# Altium project SmartHub Carrier.PrjPcb (part 2 of 2)

## Sheet 601_USBHub-Grid-Part1.SchDoc: USB Hub Grid Connections Part 1
size A2; Organization: Greenfield Tech Solutions; Address1: Molendreef 33; Address2: Ossendrecht; Address3: 4641CS; Address4: The Netherlands; DocumentNumber: P234; Revision: 0.6; SheetNumber: 7; SheetTotal: 9
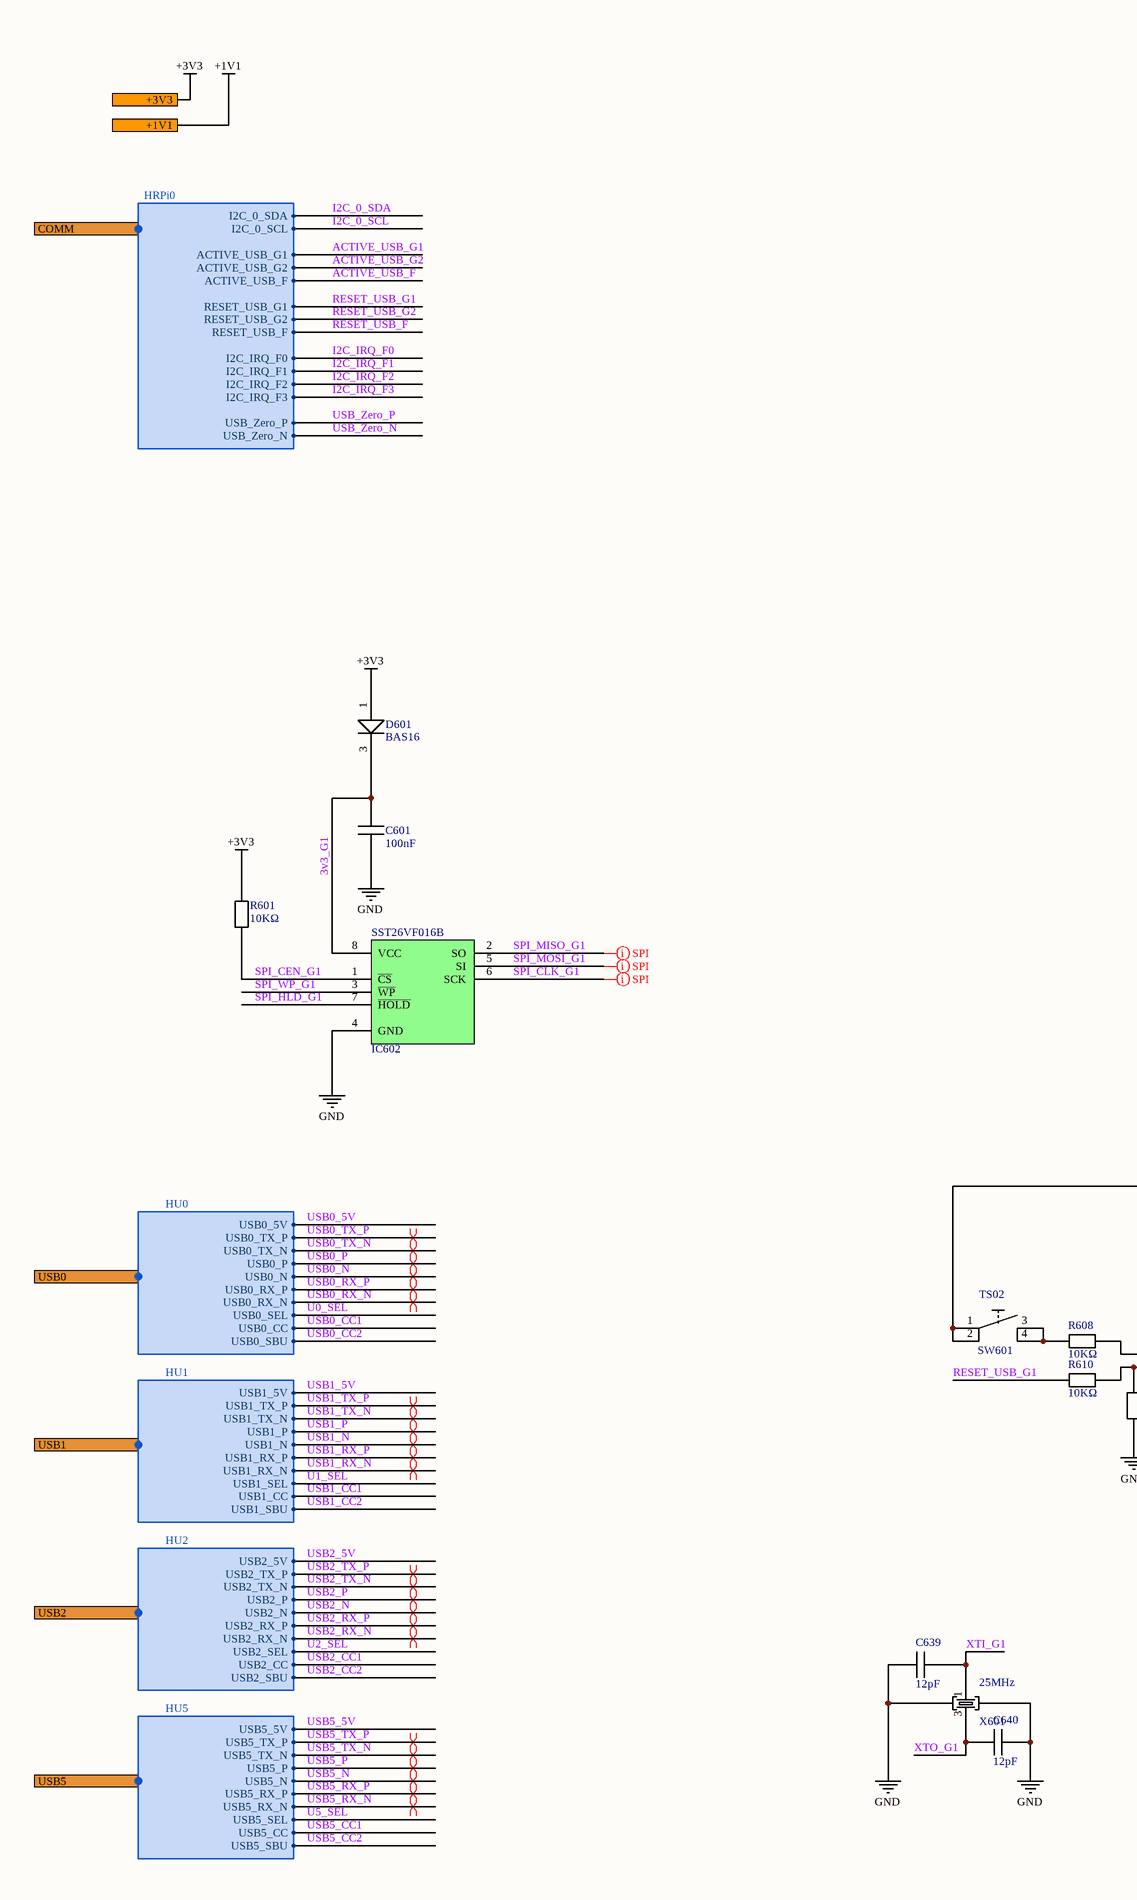
[diagram p14: 601_USBHub-Grid-Part1.SchDoc, left]
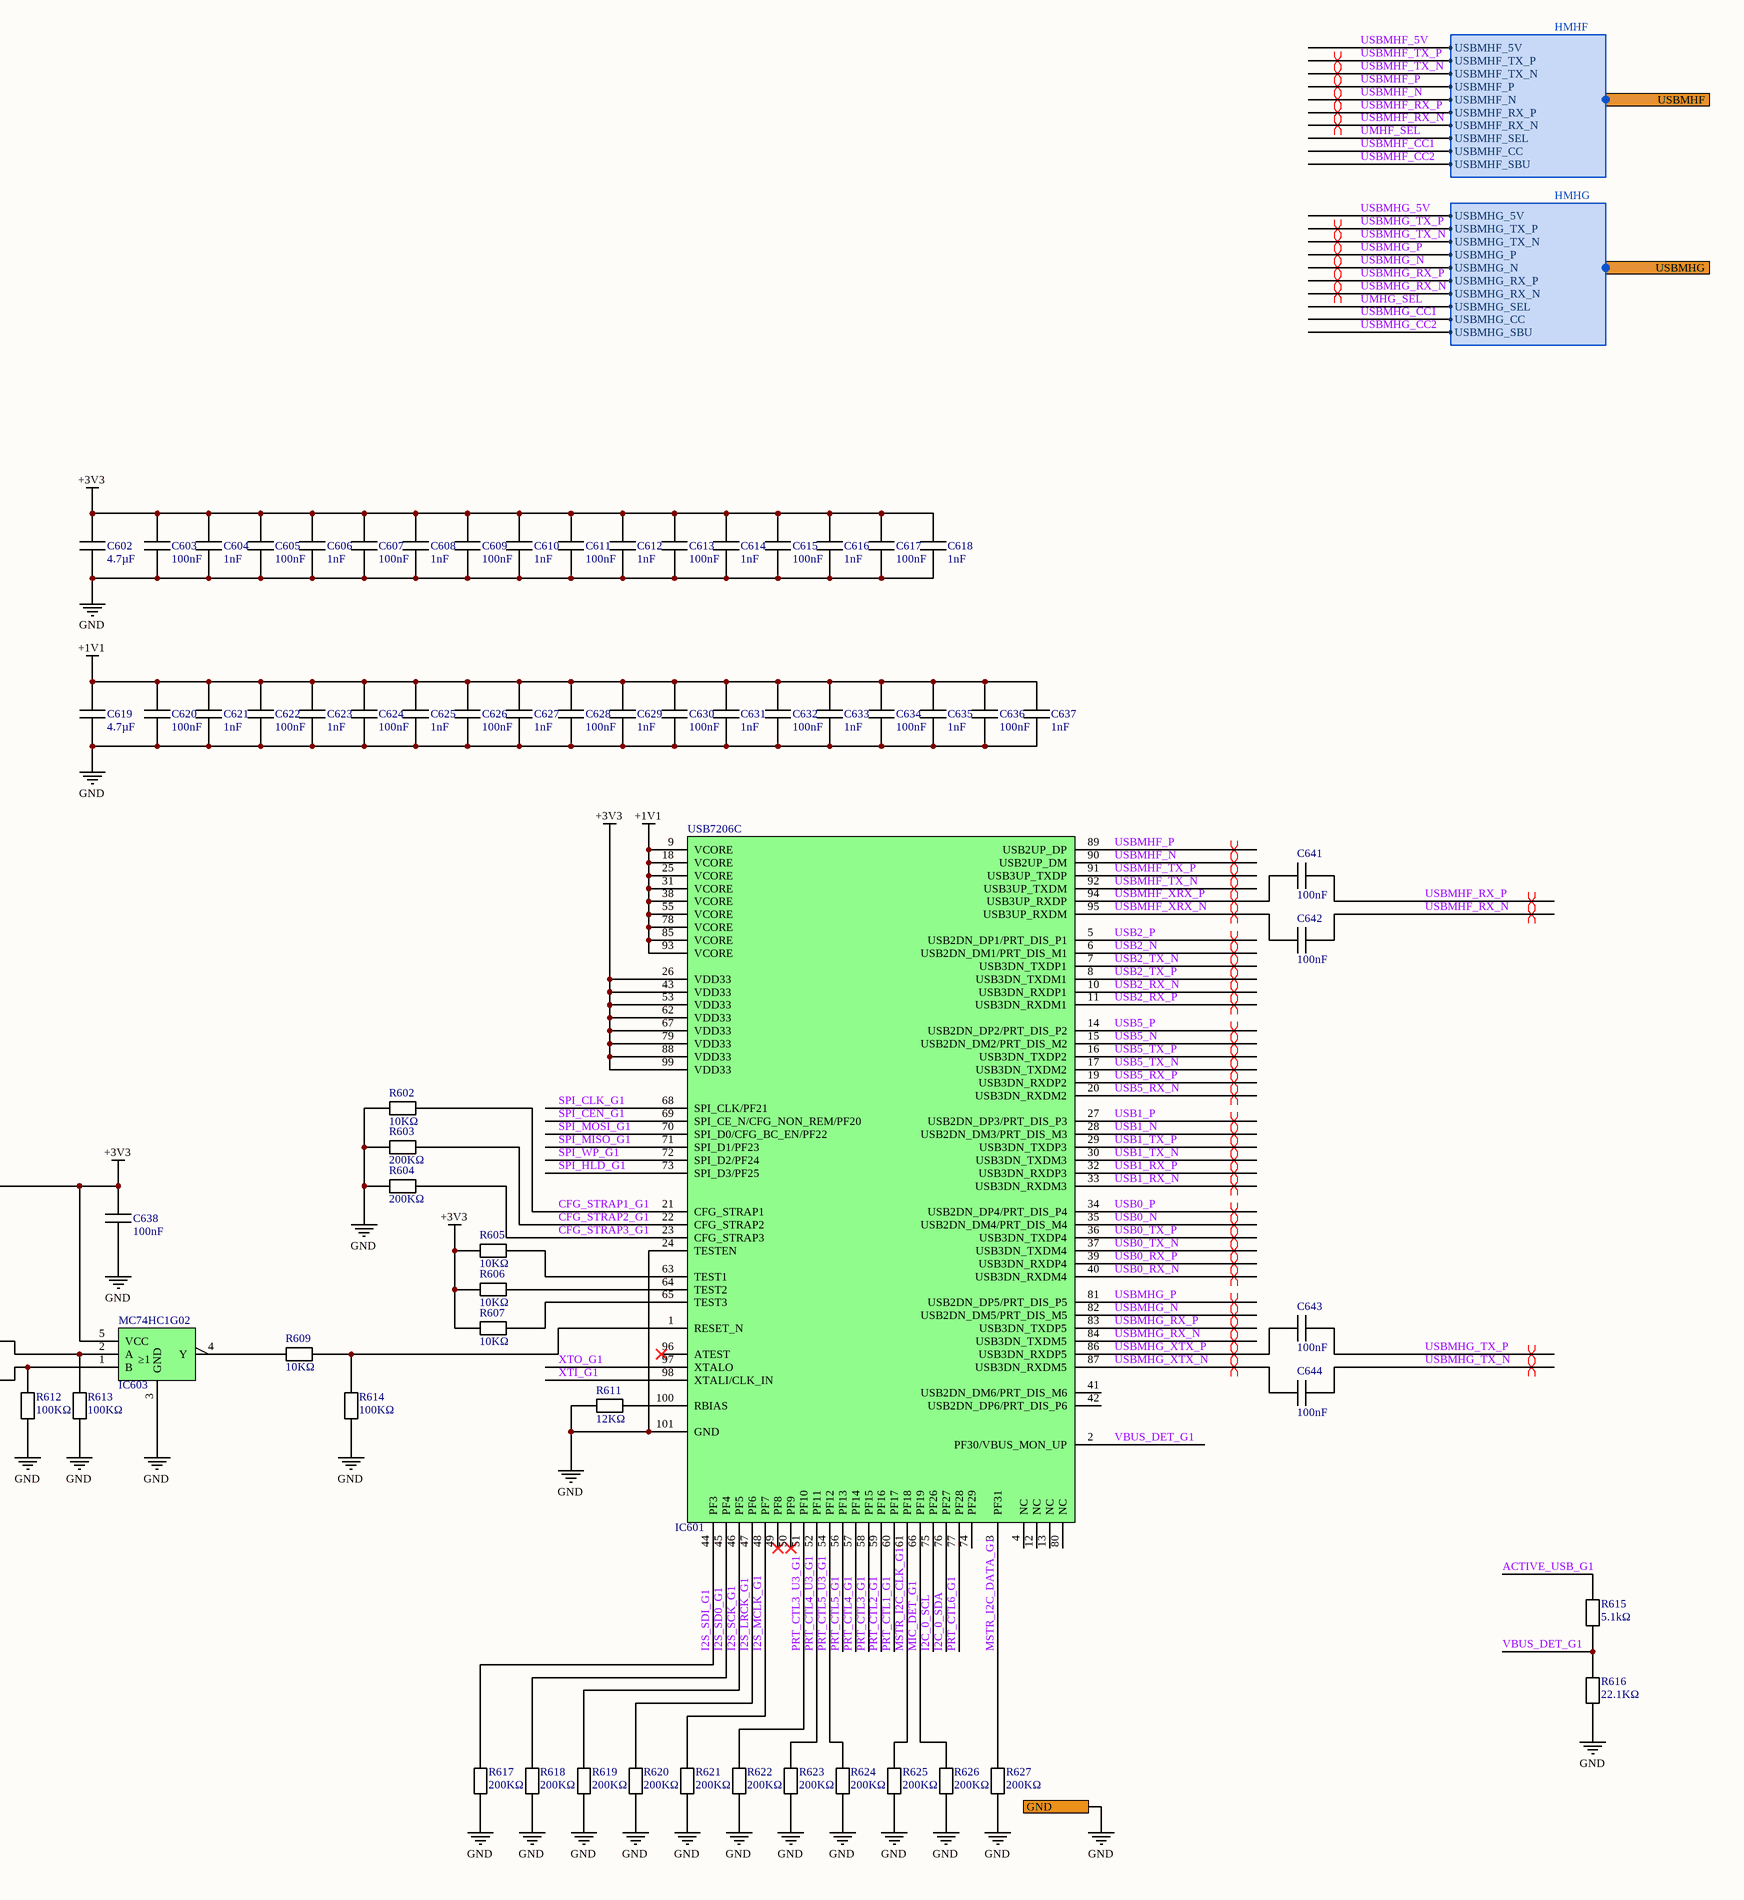
[diagram p15: 601_USBHub-Grid-Part1.SchDoc, right]

### Parts
C601  100nF  [C0402]
C602  4.7µF  [C0603]
C603  100nF  [C0402]
C604  1nF  [C0402]
C605  100nF  [C0402]
C606  1nF  [C0402]
C607  100nF  [C0402]
C608  1nF  [C0402]
C609  100nF  [C0402]
C610  1nF  [C0402]
C611  100nF  [C0402]
C612  1nF  [C0402]
C613  100nF  [C0402]
C614  1nF  [C0402]
C615  100nF  [C0402]
C616  1nF  [C0402]
C617  100nF  [C0402]
C618  1nF  [C0402]
C619  4.7µF  [C0603]
C620  100nF  [C0402]
C621  1nF  [C0402]
C622  100nF  [C0402]
C623  1nF  [C0402]
C624  100nF  [C0402]
C625  1nF  [C0402]
C626  100nF  [C0402]
C627  1nF  [C0402]
C628  100nF  [C0402]
C629  1nF  [C0402]
C630  100nF  [C0402]
C631  1nF  [C0402]
C632  100nF  [C0402]
C633  1nF  [C0402]
C634  100nF  [C0402]
C635  1nF  [C0402]
C636  100nF  [C0402]
C637  1nF  [C0402]
C638  100nF  [C0402]
C639  12pF  [C0402]
C640  12pF  [C0402]
C641  100nF  [C0402]
C642  100nF  [C0402]
C643  100nF  [C0402]
C644  100nF  [C0402]
D601  BAS16  [SOT-23]
IC601  USB7206C  [VQFN-100G_12X12]
IC602  SST26VF016B  [SO-8]
IC603  MC74HC1G02  [TSOP-5]
R601  10KΩ  [R0402]
R602  10KΩ  [R0402]
R603  200KΩ  [R0402]
R604  200KΩ  [R0402]
R605  10KΩ  [R0402]
R606  10KΩ  [R0402]
R607  10KΩ  [R0402]
R608  10KΩ  [R0402]
R609  10KΩ  [R0402]
R610  10KΩ  [R0402]
R611  12KΩ  [R0402]
R612  100KΩ  [R0402]
R613  100KΩ  [R0402]
R614  100KΩ  [R0402]
R615  5.1kΩ  [R0402]
R616  22.1KΩ  [R0603]
R617  200KΩ  [R0402]
R618  200KΩ  [R0402]
R619  200KΩ  [R0402]
R620  200KΩ  [R0402]
R621  200KΩ  [R0402]
R622  200KΩ  [R0402]
R623  200KΩ  [R0402]
R624  200KΩ  [R0402]
R625  200KΩ  [R0402]
R626  200KΩ  [R0402]
R627  200KΩ  [R0402]
SW601  TS02  [TS02]
X601  25MHz  [403W]

### Ports
+1V1, +3V3, COMM (harness HRPi0), GND, USB0 (harness HU0), USB1 (harness HU1), USB2 (harness HU2), USB5 (harness HU5), USBMHF (harness HMHF), USBMHG (harness HMHG)

### Harnesses
HU0: USB0_5V, USB0_TX_P, USB0_TX_N, USB0_N, USB0_RX_P, USB0_RX_N, USB0_SEL, USB0_P, USB0_CC, USB0_SBU
HU1: USB1_5V, USB1_TX_P, USB1_TX_N, USB1_N, USB1_RX_P, USB1_RX_N, USB1_SEL, USB1_P, USB1_CC, USB1_SBU
HU2: USB2_5V, USB2_TX_P, USB2_TX_N, USB2_N, USB2_RX_P, USB2_RX_N, USB2_SEL, USB2_P, USB2_CC, USB2_SBU
HMHF: USBMHF_5V, USBMHF_TX_P, USBMHF_TX_N, USBMHF_N, USBMHF_RX_P, USBMHF_RX_N, USBMHF_SEL, USBMHF_P, USBMHF_CC, USBMHF_SBU
HMHG: USBMHG_5V, USBMHG_TX_P, USBMHG_TX_N, USBMHG_N, USBMHG_RX_P, USBMHG_RX_N, USBMHG_SEL, USBMHG_P, USBMHG_CC, USBMHG_SBU
HU5: USB5_5V, USB5_TX_P, USB5_TX_N, USB5_N, USB5_RX_P, USB5_RX_N, USB5_SEL, USB5_P, USB5_CC, USB5_SBU
HRPi0: I2C_0_SCL, I2C_0_SDA, I2C_IRQ_F0, I2C_IRQ_F1, I2C_IRQ_F3, I2C_IRQ_F2, ACTIVE_USB_G1, ACTIVE_USB_F, ACTIVE_USB_G2, RESET_USB_G1, RESET_USB_F, RESET_USB_G2, USB_Zero_N, USB_Zero_P

### Nets
+1V1: C619.1 C620.1 C621.1 C622.1 C623.1 C624.1 C625.1 C626.1 C627.1 C628.1 C629.1 C630.1 C631.1 C632.1 C633.1 C634.1 C635.1 C636.1 C637.1 IC601.9(VCORE) IC601.18(VCORE) IC601.25(VCORE) IC601.31(VCORE) IC601.38(VCORE) IC601.55(VCORE) IC601.78(VCORE) IC601.85(VCORE) IC601.93(VCORE) ; port +1V1
+3V3: C602.1 C603.1 C604.1 C605.1 C606.1 C607.1 C608.1 C609.1 C610.1 C611.1 C612.1 C613.1 C614.1 C615.1 C616.1 C617.1 C618.1 C638.1 D601.1(A) IC601.26(VDD33) IC601.43(VDD33) IC601.53(VDD33) IC601.62(VDD33) IC601.67(VDD33) IC601.79(VDD33) IC601.88(VDD33) IC601.99(VDD33) IC603.5(VCC) R601.2 R605.1 R606.1 R607.1 SW601.1 SW601.2 ; port +3V3
GND: C601.2 C602.2 C603.2 C604.2 C605.2 C606.2 C607.2 C608.2 C609.2 C610.2 C611.2 C612.2 C613.2 C614.2 C615.2 C616.2 C617.2 C618.2 C619.2 C620.2 C621.2 C622.2 C623.2 C624.2 C625.2 C626.2 C627.2 C628.2 C629.2 C630.2 C631.2 C632.2 C633.2 C634.2 C635.2 C636.2 C637.2 C638.2 C639.1 C640.2 IC601.24(TESTEN) IC601.101(GND) IC602.4(GND) IC603.3(GND) R602.2 R603.1 R604.1 R611.1 R612.1 R613.1 R614.1 R616.1 R617.1 R618.1 R619.1 R620.1 R621.1 R622.1 R623.1 R624.1 R625.1 R626.1 R627.1 X601.2 X601.4 ; port GND
3v3_G1: C601.1 D601.3(K) IC602.8(VCC)
ACTIVE_USB_G1: R615.2 ; port COMM.ACTIVE_USB_G1
CFG_STRAP1_G1: IC601.21(CFG_STRAP1) R602.1
CFG_STRAP2_G1: IC601.22(CFG_STRAP2) R603.2
CFG_STRAP3_G1: IC601.23(CFG_STRAP3) R604.2
I2C_0_SCL: IC601.75(PF26) ; port COMM.I2C_0_SCL
I2C_0_SDA: IC601.76(PF27) ; port COMM.I2C_0_SDA
I2S_LRCK_G1: IC601.47(PF6) R620.2
I2S_MCLK_G1: IC601.48(PF7) R621.2
I2S_SCK_G1: IC601.46(PF5) R619.2
I2S_SD0_G1: IC601.45(PF4) R618.2
I2S_SDI_G1: IC601.44(PF3) R617.2
MIC_DET_G1: IC601.66(PF19) R626.2
MSTR_I2C_CLK_G1: IC601.61(PF18) R625.2
MSTR_I2C_DATA_G1: IC601.3(PF31) R627.2
PRT_CTL1_G1: IC601.60(PF17)
PRT_CTL2_G1: IC601.59(PF16)
PRT_CTL3_G1: IC601.58(PF15)
PRT_CTL3_U3_G1: IC601.51(PF10) R622.2
PRT_CTL4_G1: IC601.57(PF14)
PRT_CTL4_U3_G1: IC601.52(PF11) R623.2
PRT_CTL5_G1: IC601.56(PF13)
PRT_CTL5_U3_G1: IC601.54(PF12) R624.2
PRT_CTL6_G1: IC601.77(PF28)
RESET_USB_G1: R610.2 ; port COMM.RESET_USB_G1
SPI_CEN_G1: IC601.69(SPI_CE_N/CFG_NON_REM/PF20) IC602.1(~{CS}) R601.1
SPI_CLK_G1: IC601.68(SPI_CLK/PF21) IC602.6(SCK)
SPI_HLD_G1: IC601.73(SPI_D3/PF25) IC602.7(~{HOLD})
SPI_MISO_G1: IC601.71(SPI_D1/PF23) IC602.2(SO)
SPI_MOSI_G1: IC601.70(SPI_D0/CFG_BC_EN/PF22) IC602.5(SI)
SPI_WP_G1: IC601.72(SPI_D2/PF24) IC602.3(~{WP})
U0_SEL: port USB0.USB0_SEL
U1_SEL: port USB1.USB1_SEL
U2_SEL: port USB2.USB2_SEL
U5_SEL: port USB5.USB5_SEL
UMHF_SEL: port USBMHF.USBMHF_SEL
UMHG_SEL: port USBMHG.USBMHG_SEL
USB0_5V: port USB0.USB0_5V
USB0_CC1: port USB0.USB0_CC
USB0_CC2: port USB0.USB0_SBU
USB0_N: IC601.35(USB2DN_DM4/PRT_DIS_M4) ; port USB0.USB0_N
USB0_P: IC601.34(USB2DN_DP4/PRT_DIS_P4) ; port USB0.USB0_P
USB0_RX_N: IC601.40(USB3DN_RXDM4) ; port USB0.USB0_RX_N
USB0_RX_P: IC601.39(USB3DN_RXDP4) ; port USB0.USB0_RX_P
USB0_TX_N: IC601.37(USB3DN_TXDM4) ; port USB0.USB0_TX_N
USB0_TX_P: IC601.36(USB3DN_TXDP4) ; port USB0.USB0_TX_P
USB1_5V: port USB1.USB1_5V
USB1_CC1: port USB1.USB1_CC
USB1_CC2: port USB1.USB1_SBU
USB1_N: IC601.28(USB2DN_DM3/PRT_DIS_M3) ; port USB1.USB1_N
USB1_P: IC601.27(USB2DN_DP3/PRT_DIS_P3) ; port USB1.USB1_P
USB1_RX_N: IC601.33(USB3DN_RXDM3) ; port USB1.USB1_RX_N
USB1_RX_P: IC601.32(USB3DN_RXDP3) ; port USB1.USB1_RX_P
USB1_TX_N: IC601.30(USB3DN_TXDM3) ; port USB1.USB1_TX_N
USB1_TX_P: IC601.29(USB3DN_TXDP3) ; port USB1.USB1_TX_P
USB2_5V: port USB2.USB2_5V
USB2_CC1: port USB2.USB2_CC
USB2_CC2: port USB2.USB2_SBU
USB2_N: IC601.6(USB2DN_DM1/PRT_DIS_M1) ; port USB2.USB2_N
USB2_P: IC601.5(USB2DN_DP1/PRT_DIS_P1) ; port USB2.USB2_P
USB2_RX_N: IC601.10(USB3DN_RXDP1) ; port USB2.USB2_RX_N
USB2_RX_P: IC601.11(USB3DN_RXDM1) ; port USB2.USB2_RX_P
USB2_TX_N: IC601.7(USB3DN_TXDP1) ; port USB2.USB2_TX_N
USB2_TX_P: IC601.8(USB3DN_TXDM1) ; port USB2.USB2_TX_P
USB5_5V: port USB5.USB5_5V
USB5_CC1: port USB5.USB5_CC
USB5_CC2: port USB5.USB5_SBU
USB5_N: IC601.15(USB2DN_DM2/PRT_DIS_M2) ; port USB5.USB5_N
USB5_P: IC601.14(USB2DN_DP2/PRT_DIS_P2) ; port USB5.USB5_P
USB5_RX_N: IC601.20(USB3DN_RXDM2) ; port USB5.USB5_RX_N
USB5_RX_P: IC601.19(USB3DN_RXDP2) ; port USB5.USB5_RX_P
USB5_TX_N: IC601.17(USB3DN_TXDM2) ; port USB5.USB5_TX_N
USB5_TX_P: IC601.16(USB3DN_TXDP2) ; port USB5.USB5_TX_P
USBMHF_5V: port USBMHF.USBMHF_5V
USBMHF_CC1: port USBMHF.USBMHF_CC
USBMHF_CC2: port USBMHF.USBMHF_SBU
USBMHF_N: IC601.90(USB2UP_DM) ; port USBMHF.USBMHF_N
USBMHF_P: IC601.89(USB2UP_DP) ; port USBMHF.USBMHF_P
USBMHF_RX_N: C642.2 ; port USBMHF.USBMHF_RX_N
USBMHF_RX_P: C641.2 ; port USBMHF.USBMHF_RX_P
USBMHF_TX_N: IC601.92(USB3UP_TXDM) ; port USBMHF.USBMHF_TX_N
USBMHF_TX_P: IC601.91(USB3UP_TXDP) ; port USBMHF.USBMHF_TX_P
USBMHF_XRX_N: C642.1 IC601.95(USB3UP_RXDM)
USBMHF_XRX_P: C641.1 IC601.94(USB3UP_RXDP)
USBMHG_5V: port USBMHG.USBMHG_5V
USBMHG_CC1: port USBMHG.USBMHG_CC
USBMHG_CC2: port USBMHG.USBMHG_SBU
USBMHG_N: IC601.82(USB2DN_DM5/PRT_DIS_M5) ; port USBMHG.USBMHG_N
USBMHG_P: IC601.81(USB2DN_DP5/PRT_DIS_P5) ; port USBMHG.USBMHG_P
USBMHG_RX_N: IC601.84(USB3DN_TXDM5) ; port USBMHG.USBMHG_RX_N
USBMHG_RX_P: IC601.83(USB3DN_TXDP5) ; port USBMHG.USBMHG_RX_P
USBMHG_TX_N: C644.2 ; port USBMHG.USBMHG_TX_N
USBMHG_TX_P: C643.2 ; port USBMHG.USBMHG_TX_P
USBMHG_XTX_N: C644.1 IC601.87(USB3DN_RXDM5)
USBMHG_XTX_P: C643.1 IC601.86(USB3DN_RXDP5)
VBUS_DET_G1: IC601.2(PF30/VBUS_MON_UP) R615.1 R616.2
XTI_G1: C639.2 IC601.98(XTALI/CLK_IN) X601.1
XTO_G1: C640.1 IC601.97(XTALO) X601.3
NetIC601_1: IC601.1(RESET_N) R609.2 R614.2
NetIC601_63: IC601.63(TEST1) R605.2
NetIC601_64: IC601.64(TEST2) R606.2
NetIC601_65: IC601.65(TEST3) R607.2
NetIC601_100: IC601.100(RBIAS) R611.2
NetIC603_1: IC603.1(B) R610.1 R612.2
NetIC603_2: IC603.2(A) R608.1 R613.2
NetIC603_4: IC603.4(Y) R609.1
NetR608_2: R608.2 SW601.3 SW601.4

Not connected (* = marked no-connect by the designer): IC601 4(NC) 12(NC) 13(NC) 41(USB2DN_DM6/PRT_DIS_M6) 42(USB2DN_DP6/PRT_DIS_P6) 49(PF8)* 50(PF9)* 74(PF29) 80(NC) 96(ATEST)*

### Layout directives
differential pair; differential pair class USB3: USB0_N, USB0_P, USB0_RX_N, USB0_RX_P, USB0_TX_N, USB0_TX_P, USB1_N, USB1_P, USB1_RX_N, USB1_RX_P, USB1_TX_N, USB1_TX_P, USB2_N, USB2_P, USB2_RX_N, USB2_RX_P, USB2_TX_N, USB2_TX_P, USB5_N, USB5_P, USB5_RX_N, USB5_RX_P, USB5_TX_N, USB5_TX_P, USBMHF_N, USBMHF_P, USBMHF_RX_N, USBMHF_RX_P, USBMHF_TX_N, USBMHF_TX_P, USBMHF_XRX_N, USBMHF_XRX_P, USBMHG_N, USBMHG_P, USBMHG_RX_N, USBMHG_RX_P, USBMHG_TX_N, USBMHG_TX_P, USBMHG_XTX_N, USBMHG_XTX_P
net class SPI_GRID1: SPI_CLK_G1, SPI_MISO_G1, SPI_MOSI_G1

### Notes on the sheet
- Title
- Size:
- Date:
- File:
- A2
- Number:
- Time:
- Revision:
- Sheet
- of
- (in symbol IC0061) ≥1

### Library data of the parts
C601 C603 C605 C607 C609 C611 C613 C615 C617 C620 C622 C624 C626 C628 C630 C632 C634 C636 C638 C641-C644 = CA0010: 100nF 16V 10% X7R; Part Number: CA0010; ManfactPart: GCM155R71C104KA55D; ID: 10; RefVal: 100nF
C602 C619 = CA0002: 4.7µF 16V 10% X5R; Part Number: CA0002; ManfactPart: C1608X5R1C475K080AC; ID: 2; RefVal: 4.7µF
C604 C606 C608 C610 C612 C614 C616 C618 C621 C623 C625 C627 C629 C631 C633 C635 C637 = CA0031: 1nF 50V 1% C0G; Part Number: CA0031; ManfactPart: GRT1555C1H102FA02D; ID: 31; RefVal: 1nF
C639 C640 = CA0059: 12pF 16V 1% C0G; Part Number: CA0059; ManfactPart: VJ0402A120FXJCW1BC; ID: 59; RefVal: 12pF
D601 = DI0010: Diodes - General Purpose, Power, Switching 100Vll Signal Switching Diodes 2A; Part Number: DI0010; ManfactPart: BAS16_R1_00001; ID: 10; RefVal: BAS16
IC601 = IC0065: 6-Port USB 3.2 Gen 2 Controller Hub; Part Number: IC0065; ID: 65; RefVal: USB7206C; ManfactPart: USB7206C
IC602 = IC0059: 16 Mbit Serial Quad I/O (SQI) Flash Memory; Part Number: IC0059; ManfactPart: SST26VF016B-104I/SM; ID: 59; RefVal: SST26VF016B
IC603 = IC0061: Logic Gates 2-6V Single 2-Input NOR; Part Number: IC0061; ManfactPart: MC74HC1G02DTT1G; ID: 61; RefVal: MC74HC1G02
R601 R602 R605-R610 = RS0011: 10KΩ 1% 62.5mW; Part Number: RS0011; ManfactPart: WR04X1002FTL; ID: 11; RefVal: 10KΩ
R603 R604 R617-R627 = RS0045: 200KΩ 1% 62.5mW 100PPM; Part Number: RS0045; ManfactPart: CRG0402F200K; ID: 45; RefVal: 200KΩ
R611 = RS0015: 12KΩ 1% 62.5mW; Part Number: RS0015; ManfactPart: RC0402FR-1312KL; ID: 15; RefVal: 12KΩ
R612-R614 = RS0036: 100KΩ 1% 62.5mW 100PPM; Part Number: RS0036; ManfactPart: AC0402FR-13100KL; ID: 36; RefVal: 100KΩ
R615 = RS0038: 5.1KΩ 1% 62.5mW 100PPM; Part Number: RS0038; ManfactPart: CRCW04025K10FKEDC; ID: 38; RefVal: 5.1kΩ
R616 = RS0040: 22.1KΩ 1% 100mW 100PPM; Part Number: RS0040; ManfactPart: RC0603FR-0722K1L; ID: 40; RefVal: 22.1KΩ
SW601 = SW0005: TACTILE SWITCH SPST; Part Number: SW0005; ManfactPart: TS02-66-50-BK-160-SCR-D; ID: 5; RefVal: TS02
X601 = CR0003: 25MHz 8pF 20PPM; Part Number: CR0003; ManfactPart: 403WF25012IK; ID: 3; RefVal: 25MHz

## Sheet 801_USBHub-Framework.SchDoc: USB Hub Framework Modules
size A2; Organization: Greenfield Tech Solutions; Address1: Molendreef 33; Address2: Ossendrecht; Address3: 4641CS; Address4: The Netherlands; DocumentNumber: P234; Revision: 0.6; SheetNumber: 9; SheetTotal: 9
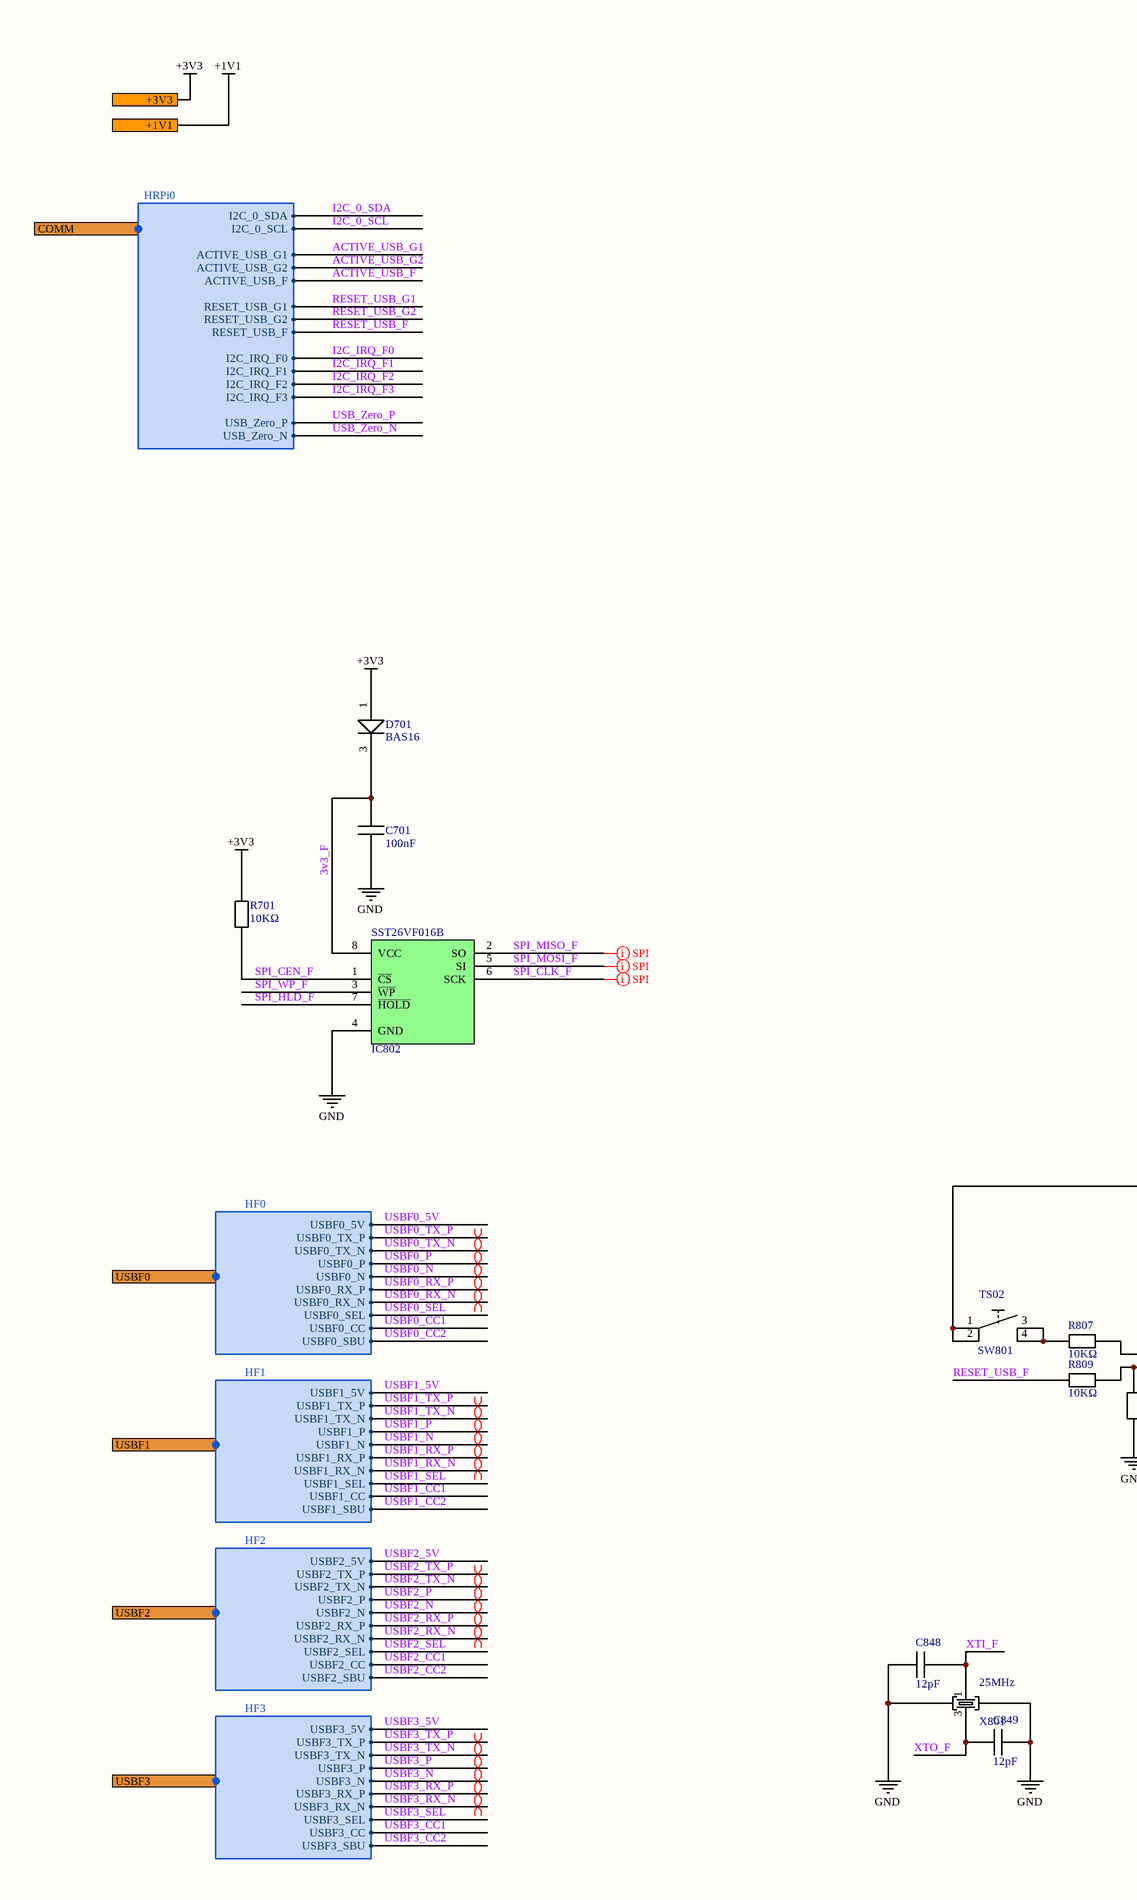
[diagram p16: 801_USBHub-Framework.SchDoc, left]
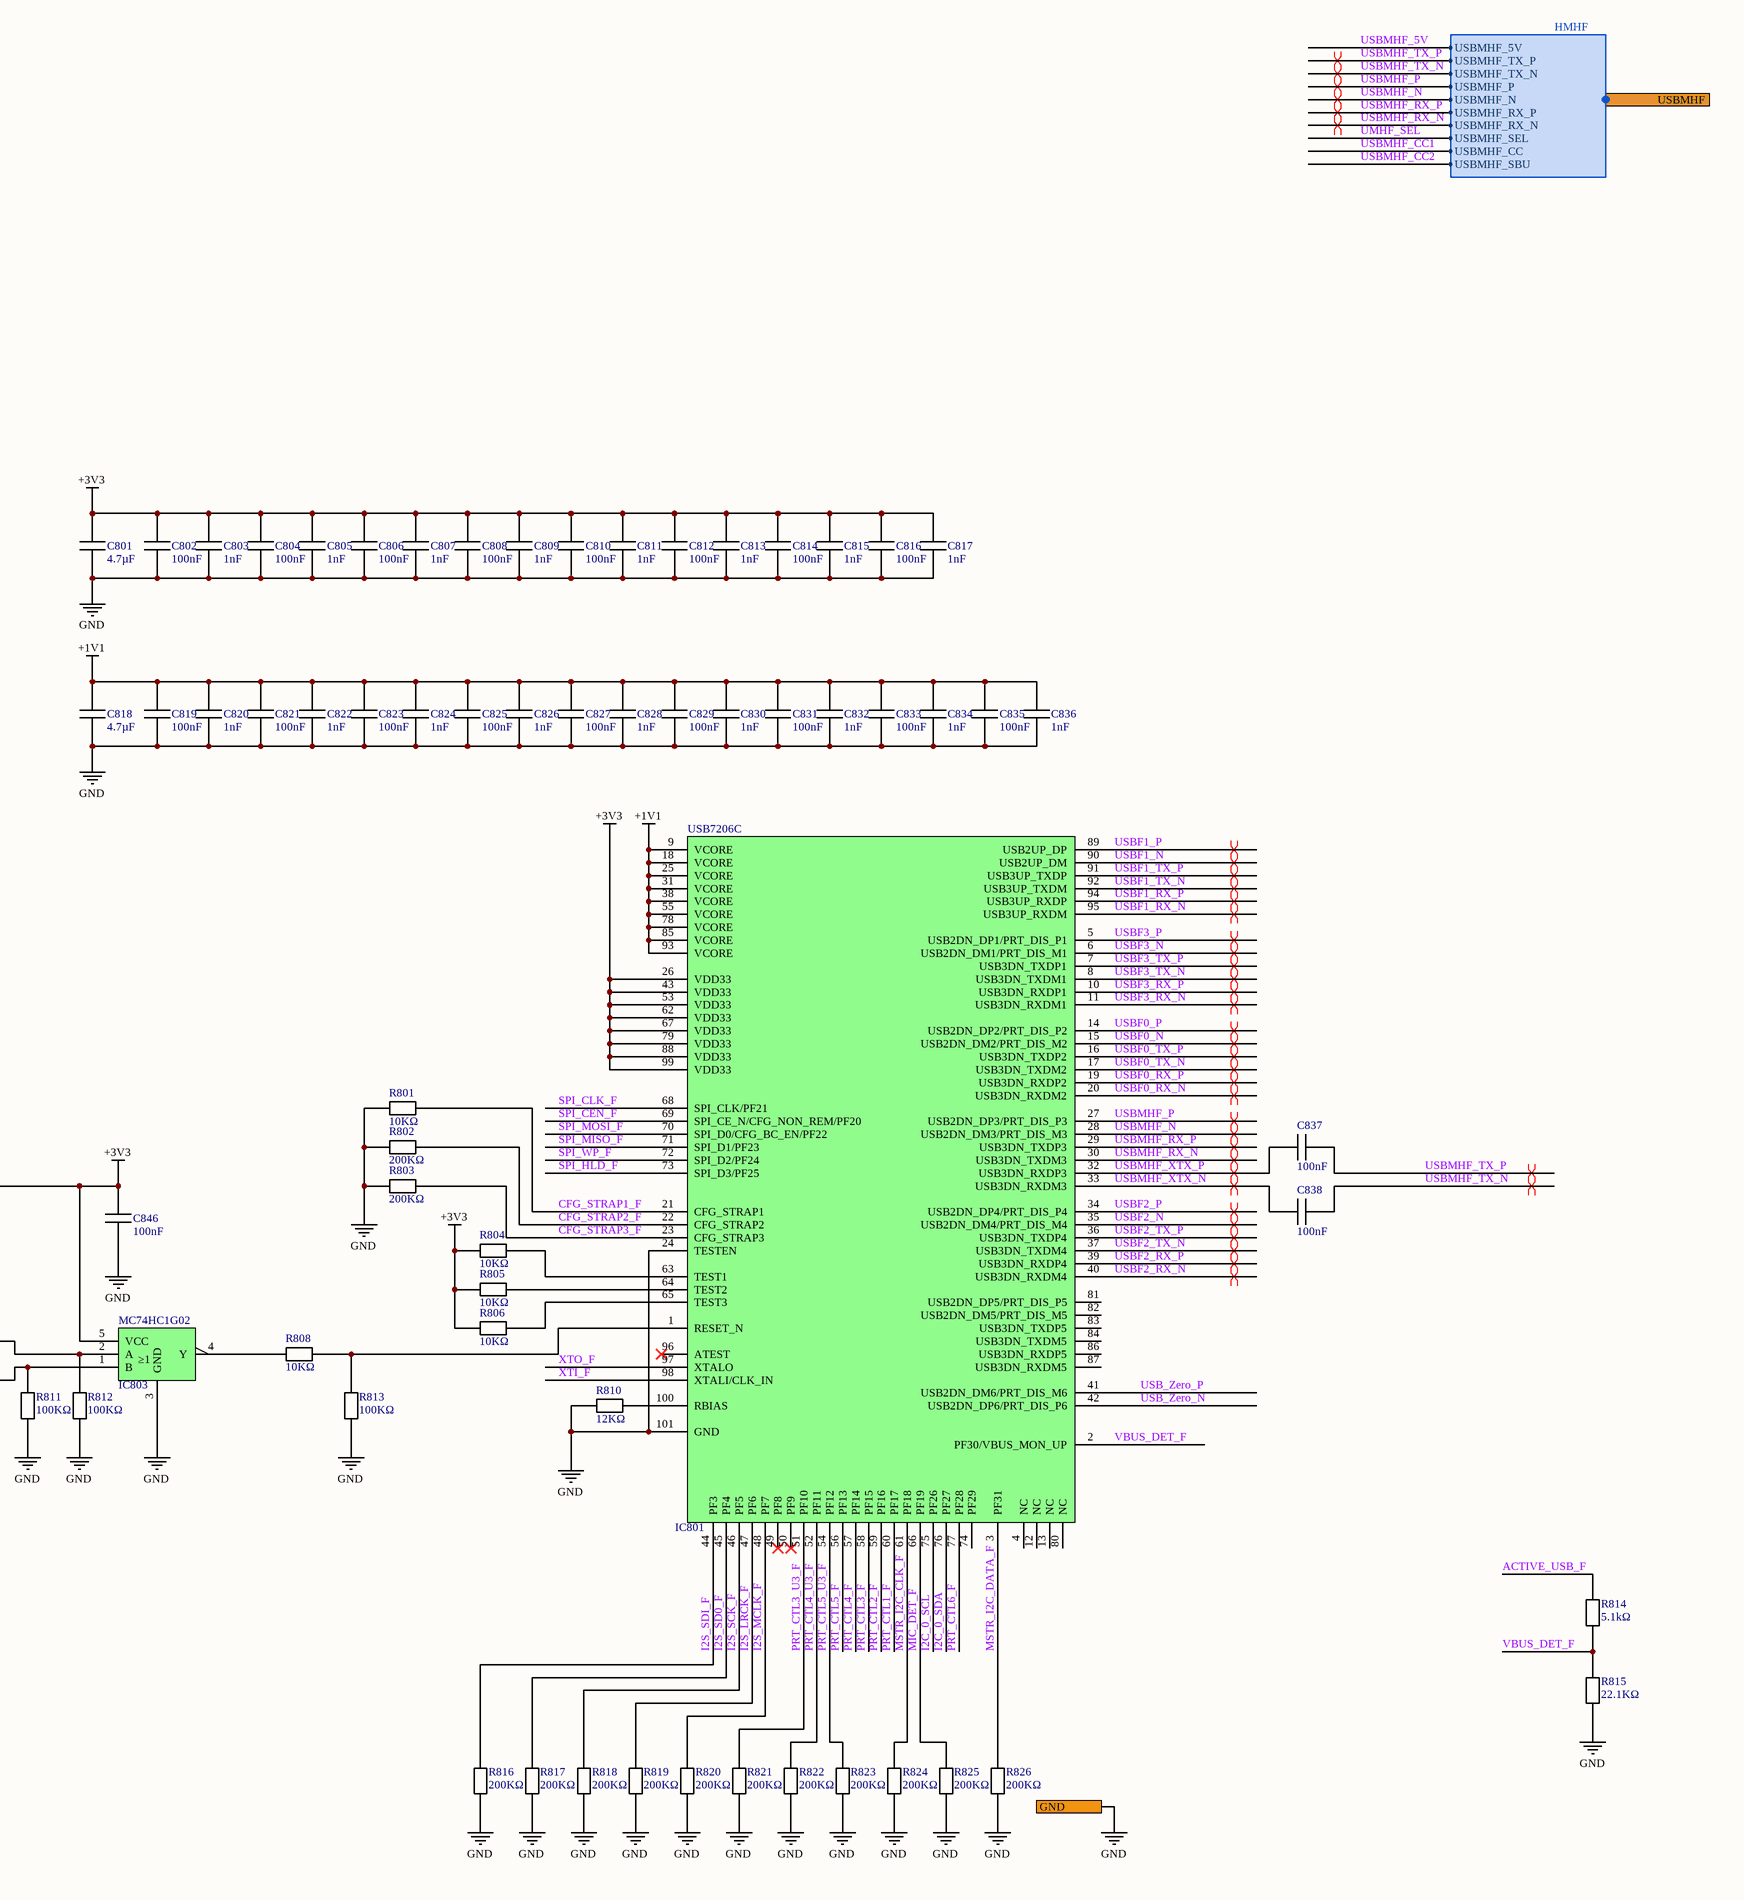
[diagram p17: 801_USBHub-Framework.SchDoc, right]

### Parts
C701  100nF  [C0402]
C801  4.7µF  [C0603]
C802  100nF  [C0402]
C803  1nF  [C0402]
C804  100nF  [C0402]
C805  1nF  [C0402]
C806  100nF  [C0402]
C807  1nF  [C0402]
C808  100nF  [C0402]
C809  1nF  [C0402]
C810  100nF  [C0402]
C811  1nF  [C0402]
C812  100nF  [C0402]
C813  1nF  [C0402]
C814  100nF  [C0402]
C815  1nF  [C0402]
C816  100nF  [C0402]
C817  1nF  [C0402]
C818  4.7µF  [C0603]
C819  100nF  [C0402]
C820  1nF  [C0402]
C821  100nF  [C0402]
C822  1nF  [C0402]
C823  100nF  [C0402]
C824  1nF  [C0402]
C825  100nF  [C0402]
C826  1nF  [C0402]
C827  100nF  [C0402]
C828  1nF  [C0402]
C829  100nF  [C0402]
C830  1nF  [C0402]
C831  100nF  [C0402]
C832  1nF  [C0402]
C833  100nF  [C0402]
C834  1nF  [C0402]
C835  100nF  [C0402]
C836  1nF  [C0402]
C837  100nF  [C0402]
C838  100nF  [C0402]
C846  100nF  [C0402]
C848  12pF  [C0402]
C849  12pF  [C0402]
D701  BAS16  [SOT-23]
IC801  USB7206C  [VQFN-100G_12X12]
IC802  SST26VF016B  [SO-8]
IC803  MC74HC1G02  [TSOP-5]
R701  10KΩ  [R0402]
R801  10KΩ  [R0402]
R802  200KΩ  [R0402]
R803  200KΩ  [R0402]
R804  10KΩ  [R0402]
R805  10KΩ  [R0402]
R806  10KΩ  [R0402]
R807  10KΩ  [R0402]
R808  10KΩ  [R0402]
R809  10KΩ  [R0402]
R810  12KΩ  [R0402]
R811  100KΩ  [R0402]
R812  100KΩ  [R0402]
R813  100KΩ  [R0402]
R814  5.1kΩ  [R0402]
R815  22.1KΩ  [R0603]
R816  200KΩ  [R0402]
R817  200KΩ  [R0402]
R818  200KΩ  [R0402]
R819  200KΩ  [R0402]
R820  200KΩ  [R0402]
R821  200KΩ  [R0402]
R822  200KΩ  [R0402]
R823  200KΩ  [R0402]
R824  200KΩ  [R0402]
R825  200KΩ  [R0402]
R826  200KΩ  [R0402]
SW801  TS02  [TS02]
X801  25MHz  [403W]

### Ports
+1V1, +3V3, COMM (harness HRPi0), GND, USBF0 (harness HF0), USBF1 (harness HF1), USBF2 (harness HF2), USBF3 (harness HF3), USBMHF (harness HMHF)

### Harnesses
HF0: USBF0_5V, USBF0_TX_P, USBF0_TX_N, USBF0_N, USBF0_RX_P, USBF0_RX_N, USBF0_SEL, USBF0_P, USBF0_CC, USBF0_SBU
HF1: USBF1_5V, USBF1_TX_P, USBF1_TX_N, USBF1_N, USBF1_RX_P, USBF1_RX_N, USBF1_SEL, USBF1_P, USBF1_CC, USBF1_SBU
HF2: USBF2_5V, USBF2_TX_P, USBF2_TX_N, USBF2_N, USBF2_RX_P, USBF2_RX_N, USBF2_SEL, USBF2_P, USBF2_CC, USBF2_SBU
HF3: USBF3_5V, USBF3_TX_P, USBF3_TX_N, USBF3_N, USBF3_RX_P, USBF3_RX_N, USBF3_SEL, USBF3_P, USBF3_CC, USBF3_SBU
HMHF: USBMHF_5V, USBMHF_TX_P, USBMHF_TX_N, USBMHF_N, USBMHF_RX_P, USBMHF_RX_N, USBMHF_SEL, USBMHF_P, USBMHF_CC, USBMHF_SBU
HRPi0: I2C_0_SCL, I2C_0_SDA, I2C_IRQ_F0, I2C_IRQ_F1, I2C_IRQ_F3, I2C_IRQ_F2, ACTIVE_USB_G1, ACTIVE_USB_F, ACTIVE_USB_G2, RESET_USB_G1, RESET_USB_F, RESET_USB_G2, USB_Zero_N, USB_Zero_P

### Nets
+1V1: C818.1 C819.1 C820.1 C821.1 C822.1 C823.1 C824.1 C825.1 C826.1 C827.1 C828.1 C829.1 C830.1 C831.1 C832.1 C833.1 C834.1 C835.1 C836.1 IC801.9(VCORE) IC801.18(VCORE) IC801.25(VCORE) IC801.31(VCORE) IC801.38(VCORE) IC801.55(VCORE) IC801.78(VCORE) IC801.85(VCORE) IC801.93(VCORE) ; port +1V1
+3V3: C801.1 C802.1 C803.1 C804.1 C805.1 C806.1 C807.1 C808.1 C809.1 C810.1 C811.1 C812.1 C813.1 C814.1 C815.1 C816.1 C817.1 C846.1 D701.1(A) IC801.26(VDD33) IC801.43(VDD33) IC801.53(VDD33) IC801.62(VDD33) IC801.67(VDD33) IC801.79(VDD33) IC801.88(VDD33) IC801.99(VDD33) IC803.5(VCC) R701.2 R804.1 R805.1 R806.1 SW801.1 SW801.2 ; port +3V3
GND: C701.2 C801.2 C802.2 C803.2 C804.2 C805.2 C806.2 C807.2 C808.2 C809.2 C810.2 C811.2 C812.2 C813.2 C814.2 C815.2 C816.2 C817.2 C818.2 C819.2 C820.2 C821.2 C822.2 C823.2 C824.2 C825.2 C826.2 C827.2 C828.2 C829.2 C830.2 C831.2 C832.2 C833.2 C834.2 C835.2 C836.2 C846.2 C848.1 C849.2 IC801.24(TESTEN) IC801.101(GND) IC802.4(GND) IC803.3(GND) R801.2 R802.1 R803.1 R810.1 R811.1 R812.1 R813.1 R815.1 R816.1 R817.1 R818.1 R819.1 R820.1 R821.1 R822.1 R823.1 R824.1 R825.1 R826.1 X801.2 X801.4 ; port GND
3v3_F: C701.1 D701.3(K) IC802.8(VCC)
ACTIVE_USB_F: R814.2 ; port COMM.ACTIVE_USB_F
CFG_STRAP1_F: IC801.21(CFG_STRAP1) R801.1
CFG_STRAP2_F: IC801.22(CFG_STRAP2) R802.2
CFG_STRAP3_F: IC801.23(CFG_STRAP3) R803.2
I2C_0_SCL: IC801.75(PF26) ; port COMM.I2C_0_SCL
I2C_0_SDA: IC801.76(PF27) ; port COMM.I2C_0_SDA
I2S_LRCK_F: IC801.47(PF6) R819.2
I2S_MCLK_F: IC801.48(PF7) R820.2
I2S_SCK_F: IC801.46(PF5) R818.2
I2S_SD0_F: IC801.45(PF4) R817.2
I2S_SDI_F: IC801.44(PF3) R816.2
MIC_DET_F: IC801.66(PF19) R825.2
MSTR_I2C_CLK_F: IC801.61(PF18) R824.2
MSTR_I2C_DATA_F: IC801.3(PF31) R826.2
PRT_CTL1_F: IC801.60(PF17)
PRT_CTL2_F: IC801.59(PF16)
PRT_CTL3_F: IC801.58(PF15)
PRT_CTL3_U3_F: IC801.51(PF10) R821.2
PRT_CTL4_F: IC801.57(PF14)
PRT_CTL4_U3_F: IC801.52(PF11) R822.2
PRT_CTL5_F: IC801.56(PF13)
PRT_CTL5_U3_F: IC801.54(PF12) R823.2
PRT_CTL6_F: IC801.77(PF28)
RESET_USB_F: R809.2 ; port COMM.RESET_USB_F
SPI_CEN_F: IC801.69(SPI_CE_N/CFG_NON_REM/PF20) IC802.1(~{CS}) R701.1
SPI_CLK_F: IC801.68(SPI_CLK/PF21) IC802.6(SCK)
SPI_HLD_F: IC801.73(SPI_D3/PF25) IC802.7(~{HOLD})
SPI_MISO_F: IC801.71(SPI_D1/PF23) IC802.2(SO)
SPI_MOSI_F: IC801.70(SPI_D0/CFG_BC_EN/PF22) IC802.5(SI)
SPI_WP_F: IC801.72(SPI_D2/PF24) IC802.3(~{WP})
UMHF_SEL: port USBMHF.USBMHF_SEL
USB_Zero_N: IC801.42(USB2DN_DP6/PRT_DIS_P6) ; port COMM.USB_Zero_N
USB_Zero_P: IC801.41(USB2DN_DM6/PRT_DIS_M6) ; port COMM.USB_Zero_P
USBF0_N: IC801.15(USB2DN_DM2/PRT_DIS_M2) ; port USBF0.USBF0_N
USBF0_P: IC801.14(USB2DN_DP2/PRT_DIS_P2) ; port USBF0.USBF0_P
USBF0_RX_N: IC801.20(USB3DN_RXDM2) ; port USBF0.USBF0_RX_N
USBF0_RX_P: IC801.19(USB3DN_RXDP2) ; port USBF0.USBF0_RX_P
USBF0_TX_N: IC801.17(USB3DN_TXDM2) ; port USBF0.USBF0_TX_N
USBF0_TX_P: IC801.16(USB3DN_TXDP2) ; port USBF0.USBF0_TX_P
USBF1_N: IC801.90(USB2UP_DM) ; port USBF1.USBF1_N
USBF1_P: IC801.89(USB2UP_DP) ; port USBF1.USBF1_P
USBF1_RX_N: IC801.95(USB3UP_RXDM) ; port USBF1.USBF1_RX_N
USBF1_RX_P: IC801.94(USB3UP_RXDP) ; port USBF1.USBF1_RX_P
USBF1_TX_N: IC801.92(USB3UP_TXDM) ; port USBF1.USBF1_TX_N
USBF1_TX_P: IC801.91(USB3UP_TXDP) ; port USBF1.USBF1_TX_P
USBF2_N: IC801.35(USB2DN_DM4/PRT_DIS_M4) ; port USBF2.USBF2_N
USBF2_P: IC801.34(USB2DN_DP4/PRT_DIS_P4) ; port USBF2.USBF2_P
USBF2_RX_N: IC801.40(USB3DN_RXDM4) ; port USBF2.USBF2_RX_N
USBF2_RX_P: IC801.39(USB3DN_RXDP4) ; port USBF2.USBF2_RX_P
USBF2_TX_N: IC801.37(USB3DN_TXDM4) ; port USBF2.USBF2_TX_N
USBF2_TX_P: IC801.36(USB3DN_TXDP4) ; port USBF2.USBF2_TX_P
USBF3_N: IC801.6(USB2DN_DM1/PRT_DIS_M1) ; port USBF3.USBF3_N
USBF3_P: IC801.5(USB2DN_DP1/PRT_DIS_P1) ; port USBF3.USBF3_P
USBF3_RX_N: IC801.11(USB3DN_RXDM1) ; port USBF3.USBF3_RX_N
USBF3_RX_P: IC801.10(USB3DN_RXDP1) ; port USBF3.USBF3_RX_P
USBF3_TX_N: IC801.8(USB3DN_TXDM1) ; port USBF3.USBF3_TX_N
USBF3_TX_P: IC801.7(USB3DN_TXDP1) ; port USBF3.USBF3_TX_P
USBMHF_5V: port USBMHF.USBMHF_5V
USBMHF_CC1: port USBMHF.USBMHF_CC
USBMHF_CC2: port USBMHF.USBMHF_SBU
USBMHF_N: IC801.28(USB2DN_DM3/PRT_DIS_M3) ; port USBMHF.USBMHF_N
USBMHF_P: IC801.27(USB2DN_DP3/PRT_DIS_P3) ; port USBMHF.USBMHF_P
USBMHF_RX_N: IC801.30(USB3DN_TXDM3) ; port USBMHF.USBMHF_RX_N
USBMHF_RX_P: IC801.29(USB3DN_TXDP3) ; port USBMHF.USBMHF_RX_P
USBMHF_TX_N: C838.2 ; port USBMHF.USBMHF_TX_N
USBMHF_TX_P: C837.2 ; port USBMHF.USBMHF_TX_P
USBMHF_XTX_N: C838.1 IC801.33(USB3DN_RXDM3)
USBMHF_XTX_P: C837.1 IC801.32(USB3DN_RXDP3)
VBUS_DET_F: IC801.2(PF30/VBUS_MON_UP) R814.1 R815.2
XTI_F: C848.2 IC801.98(XTALI/CLK_IN) X801.1
XTO_F: C849.1 IC801.97(XTALO) X801.3
NetIC801_1: IC801.1(RESET_N) R808.2 R813.2
NetIC801_63: IC801.63(TEST1) R804.2
NetIC801_64: IC801.64(TEST2) R805.2
NetIC801_65: IC801.65(TEST3) R806.2
NetIC801_100: IC801.100(RBIAS) R810.2
NetIC803_1: IC803.1(B) R809.1 R811.2
NetIC803_2: IC803.2(A) R807.1 R812.2
NetIC803_4: IC803.4(Y) R808.1
NetR807_2: R807.2 SW801.3 SW801.4

Not connected (* = marked no-connect by the designer): IC801 4(NC) 12(NC) 13(NC) 49(PF8)* 50(PF9)* 74(PF29) 80(NC) 81(USB2DN_DP5/PRT_DIS_P5) 82(USB2DN_DM5/PRT_DIS_M5) 83(USB3DN_TXDP5) 84(USB3DN_TXDM5) 86(USB3DN_RXDP5) 87(USB3DN_RXDM5) 96(ATEST)*

### Layout directives
differential pair; differential pair class USB3: USBF0_N, USBF0_P, USBF0_RX_N, USBF0_RX_P, USBF0_TX_N, USBF0_TX_P, USBF1_N, USBF1_P, USBF1_RX_N, USBF1_RX_P, USBF1_TX_N, USBF1_TX_P, USBF2_N, USBF2_P, USBF2_RX_N, USBF2_RX_P, USBF2_TX_N, USBF2_TX_P, USBF3_N, USBF3_P, USBF3_RX_N, USBF3_RX_P, USBF3_TX_N, USBF3_TX_P, USBMHF_N, USBMHF_P, USBMHF_RX_N, USBMHF_RX_P, USBMHF_TX_N, USBMHF_TX_P, USBMHF_XTX_N, USBMHF_XTX_P
net class SPI_FW: SPI_CLK_F, SPI_MISO_F, SPI_MOSI_F

### Notes on the sheet
- Title
- Size:
- Date:
- File:
- A2
- Number:
- Time:
- Revision:
- Sheet
- of
- (in symbol IC0061) ≥1

### Library data of the parts
C701 C802 C804 C806 C808 C810 C812 C814 C816 C819 C821 C823 C825 C827 C829 C831 C833 C835 C837 C838 C846 = CA0010: as C601 on sheet 601_USBHub-Grid-Part1; RefVal: 100nF
C801 C818 = CA0002: as C602 on sheet 601_USBHub-Grid-Part1; RefVal: 4.7µF
C803 C805 C807 C809 C811 C813 C815 C817 C820 C822 C824 C826 C828 C830 C832 C834 C836 = CA0031: as C604 on sheet 601_USBHub-Grid-Part1; RefVal: 1nF
C848 C849 = CA0059: as C639 on sheet 601_USBHub-Grid-Part1; RefVal: 12pF
D701 = DI0010: as D601 on sheet 601_USBHub-Grid-Part1; RefVal: BAS16
IC801 = IC0065: as IC601 on sheet 601_USBHub-Grid-Part1; RefVal: USB7206C; ManfactPart: USB7206C
IC802 = IC0059: as IC602 on sheet 601_USBHub-Grid-Part1; RefVal: SST26VF016B
IC803 = IC0061: as IC603 on sheet 601_USBHub-Grid-Part1; RefVal: MC74HC1G02
R701 R801 R804-R809 = RS0011: as R601 on sheet 601_USBHub-Grid-Part1; RefVal: 10KΩ
R802 R803 R816-R826 = RS0045: as R603 on sheet 601_USBHub-Grid-Part1; RefVal: 200KΩ
R810 = RS0015: as R611 on sheet 601_USBHub-Grid-Part1; RefVal: 12KΩ
R811-R813 = RS0036: as R612-R614 on sheet 601_USBHub-Grid-Part1; RefVal: 100KΩ
R814 = RS0038: as R615 on sheet 601_USBHub-Grid-Part1; RefVal: 5.1kΩ
R815 = RS0040: as R616 on sheet 601_USBHub-Grid-Part1; RefVal: 22.1KΩ
SW801 = SW0005: as SW601 on sheet 601_USBHub-Grid-Part1; RefVal: TS02
X801 = CR0003: as X601 on sheet 601_USBHub-Grid-Part1; RefVal: 25MHz

## Sheet 701_USBHub-Grid-Part2.SchDoc: USB Hub Grid Connections Part 2
size A2; Organization: Greenfield Tech Solutions; Address1: Molendreef 33; Address2: Ossendrecht; Address3: 4641CS; Address4: The Netherlands; DocumentNumber: P234; Revision: 0.6; SheetNumber: 8; SheetTotal: 9
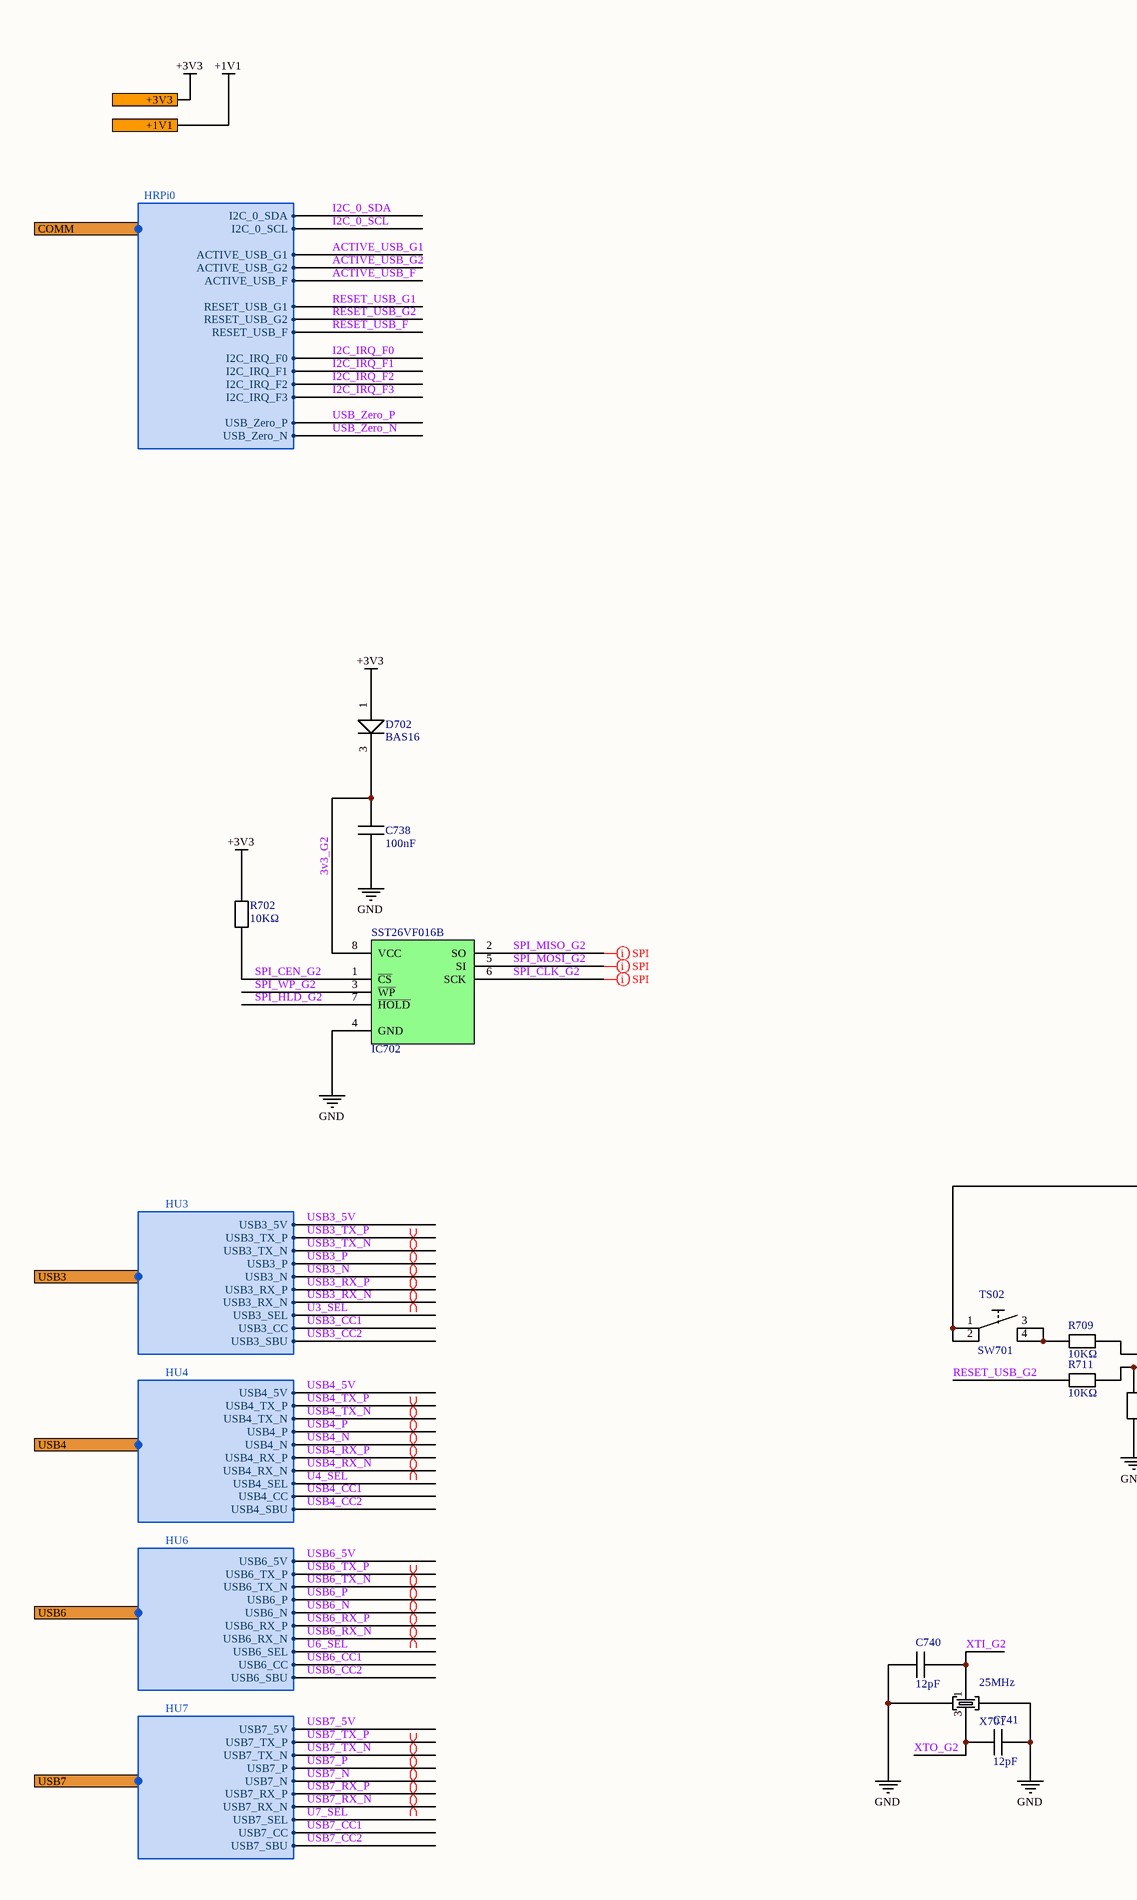
[diagram p18: 701_USBHub-Grid-Part2.SchDoc, left]
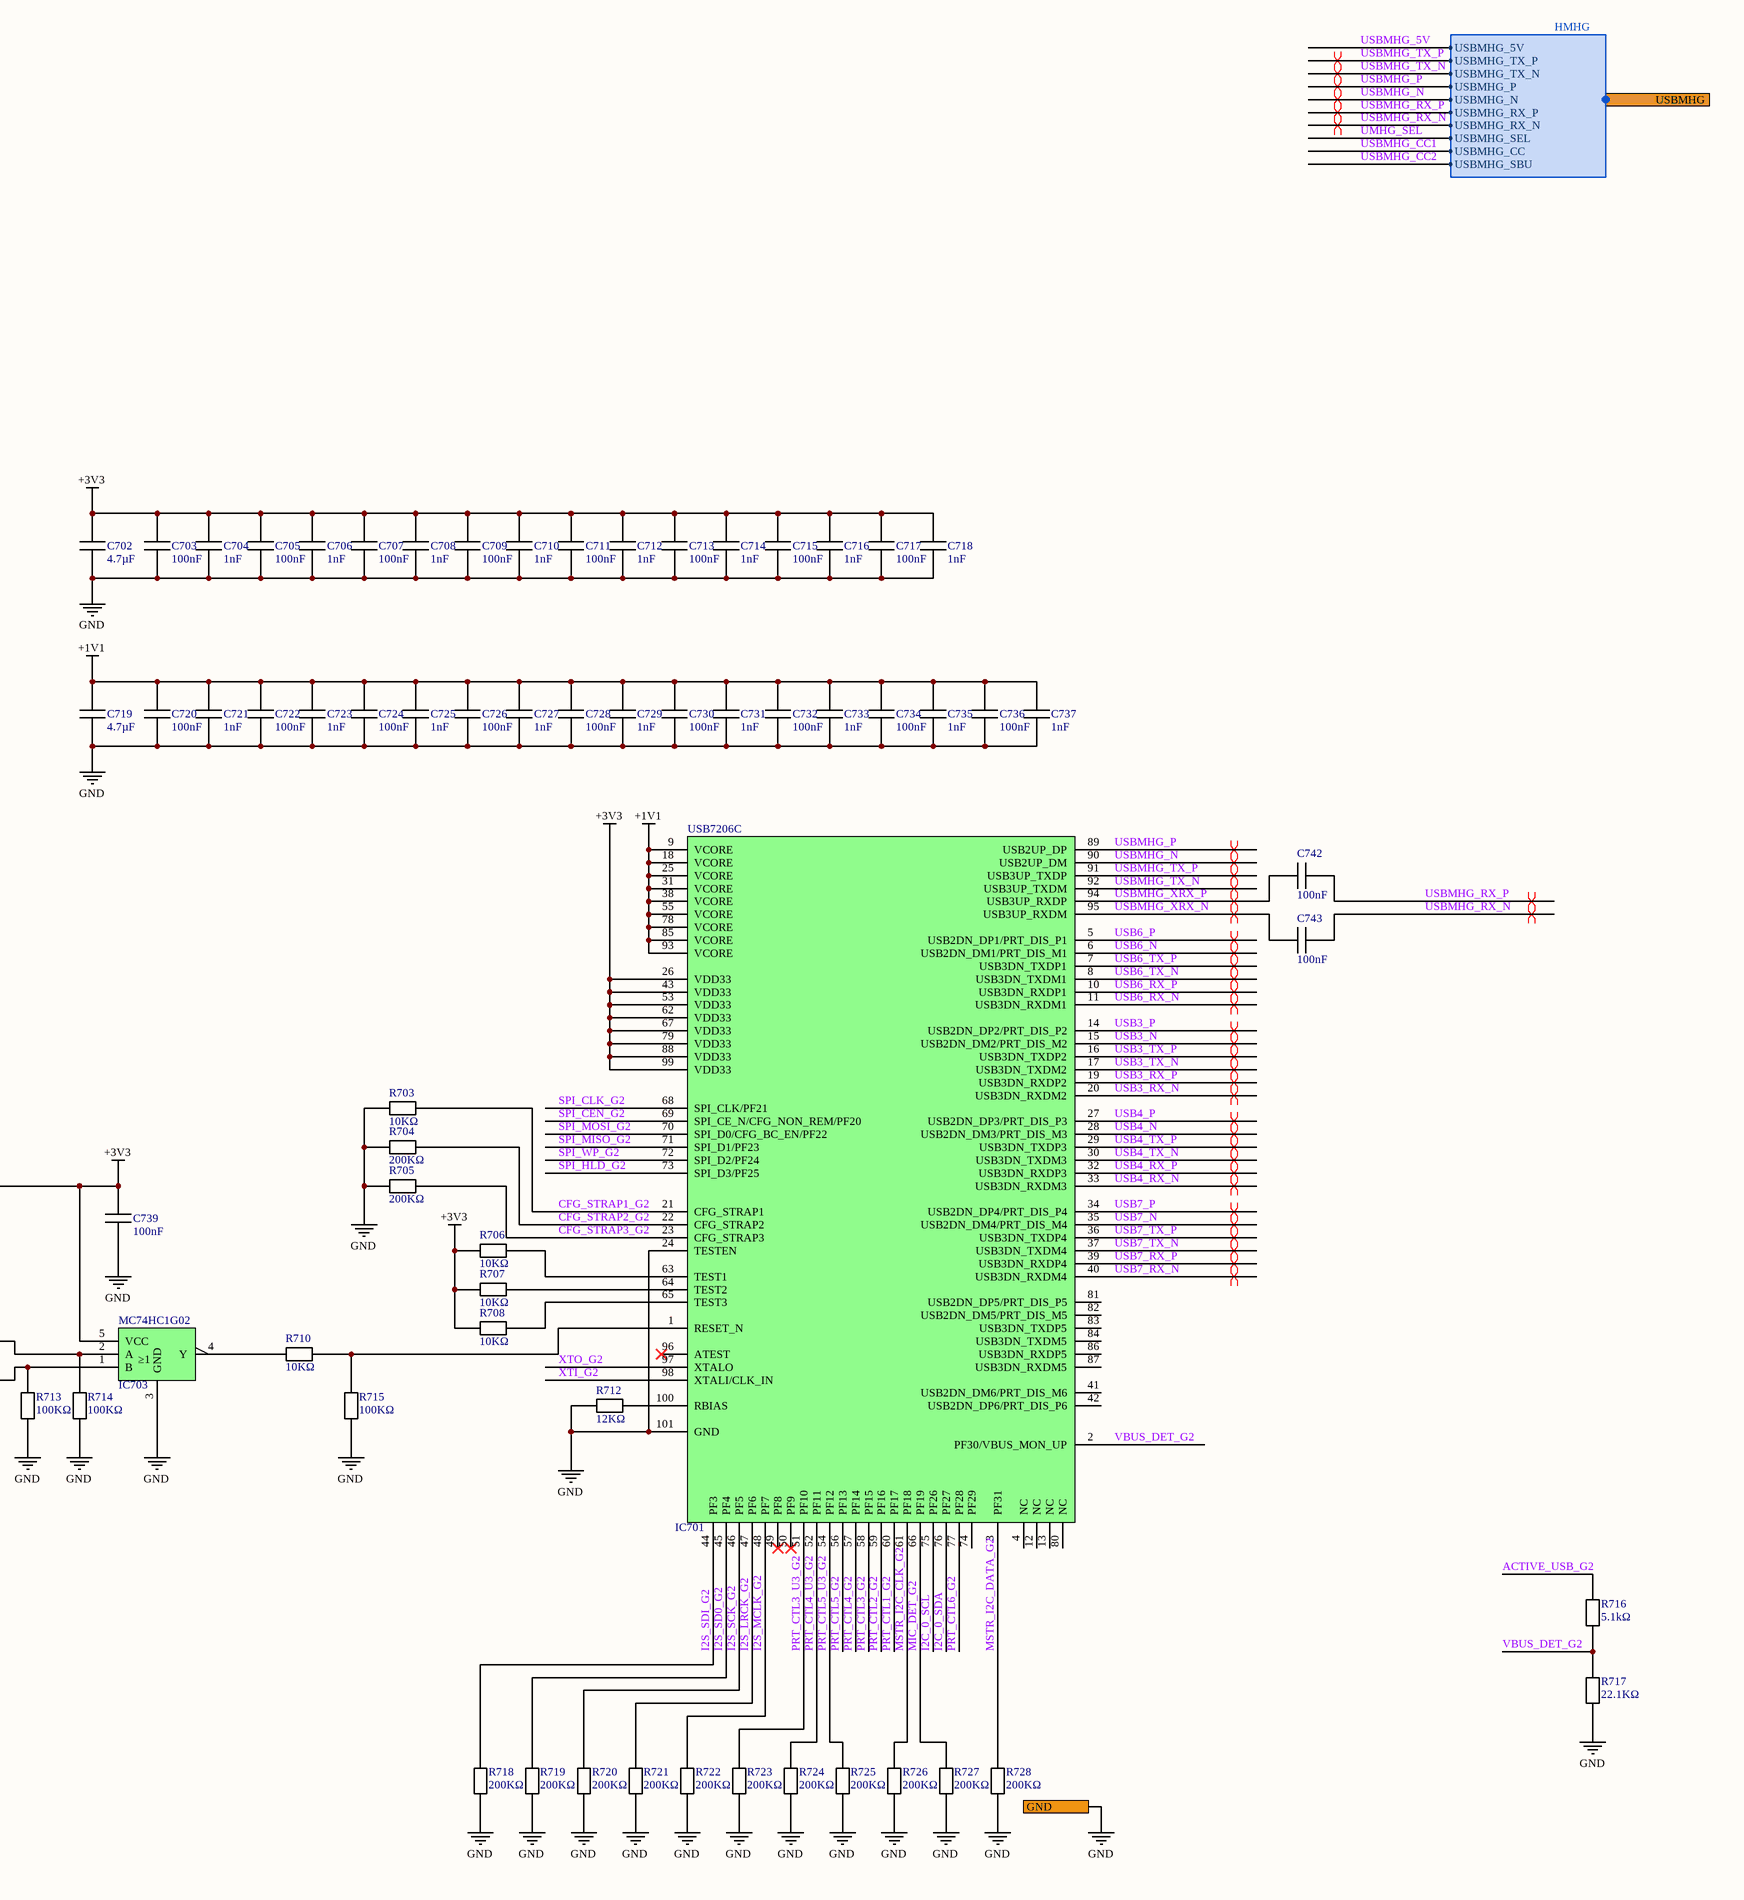
[diagram p19: 701_USBHub-Grid-Part2.SchDoc, right]

### Parts
C702  4.7µF  [C0603]
C703  100nF  [C0402]
C704  1nF  [C0402]
C705  100nF  [C0402]
C706  1nF  [C0402]
C707  100nF  [C0402]
C708  1nF  [C0402]
C709  100nF  [C0402]
C710  1nF  [C0402]
C711  100nF  [C0402]
C712  1nF  [C0402]
C713  100nF  [C0402]
C714  1nF  [C0402]
C715  100nF  [C0402]
C716  1nF  [C0402]
C717  100nF  [C0402]
C718  1nF  [C0402]
C719  4.7µF  [C0603]
C720  100nF  [C0402]
C721  1nF  [C0402]
C722  100nF  [C0402]
C723  1nF  [C0402]
C724  100nF  [C0402]
C725  1nF  [C0402]
C726  100nF  [C0402]
C727  1nF  [C0402]
C728  100nF  [C0402]
C729  1nF  [C0402]
C730  100nF  [C0402]
C731  1nF  [C0402]
C732  100nF  [C0402]
C733  1nF  [C0402]
C734  100nF  [C0402]
C735  1nF  [C0402]
C736  100nF  [C0402]
C737  1nF  [C0402]
C738  100nF  [C0402]
C739  100nF  [C0402]
C740  12pF  [C0402]
C741  12pF  [C0402]
C742  100nF  [C0402]
C743  100nF  [C0402]
D702  BAS16  [SOT-23]
IC701  USB7206C  [VQFN-100G_12X12]
IC702  SST26VF016B  [SO-8]
IC703  MC74HC1G02  [TSOP-5]
R702  10KΩ  [R0402]
R703  10KΩ  [R0402]
R704  200KΩ  [R0402]
R705  200KΩ  [R0402]
R706  10KΩ  [R0402]
R707  10KΩ  [R0402]
R708  10KΩ  [R0402]
R709  10KΩ  [R0402]
R710  10KΩ  [R0402]
R711  10KΩ  [R0402]
R712  12KΩ  [R0402]
R713  100KΩ  [R0402]
R714  100KΩ  [R0402]
R715  100KΩ  [R0402]
R716  5.1kΩ  [R0402]
R717  22.1KΩ  [R0603]
R718  200KΩ  [R0402]
R719  200KΩ  [R0402]
R720  200KΩ  [R0402]
R721  200KΩ  [R0402]
R722  200KΩ  [R0402]
R723  200KΩ  [R0402]
R724  200KΩ  [R0402]
R725  200KΩ  [R0402]
R726  200KΩ  [R0402]
R727  200KΩ  [R0402]
R728  200KΩ  [R0402]
SW701  TS02  [TS02]
X701  25MHz  [403W]

### Ports
+1V1, +3V3, COMM (harness HRPi0), GND, USB3 (harness HU3), USB4 (harness HU4), USB6 (harness HU6), USB7 (harness HU7), USBMHG (harness HMHG)

### Harnesses
HU4: USB4_5V, USB4_TX_P, USB4_TX_N, USB4_N, USB4_RX_P, USB4_RX_N, USB4_SEL, USB4_P, USB4_CC, USB4_SBU
HU7: USB7_5V, USB7_TX_P, USB7_TX_N, USB7_N, USB7_RX_P, USB7_RX_N, USB7_SEL, USB7_P, USB7_CC, USB7_SBU
HU6: USB6_5V, USB6_TX_P, USB6_TX_N, USB6_N, USB6_RX_P, USB6_RX_N, USB6_SEL, USB6_P, USB6_CC, USB6_SBU
HMHG: USBMHG_5V, USBMHG_TX_P, USBMHG_TX_N, USBMHG_N, USBMHG_RX_P, USBMHG_RX_N, USBMHG_SEL, USBMHG_P, USBMHG_CC, USBMHG_SBU
HU3: USB3_5V, USB3_TX_P, USB3_TX_N, USB3_N, USB3_RX_P, USB3_RX_N, USB3_SEL, USB3_P, USB3_CC, USB3_SBU
HRPi0: I2C_0_SCL, I2C_0_SDA, I2C_IRQ_F0, I2C_IRQ_F1, I2C_IRQ_F3, I2C_IRQ_F2, ACTIVE_USB_G1, ACTIVE_USB_F, ACTIVE_USB_G2, RESET_USB_G1, RESET_USB_F, RESET_USB_G2, USB_Zero_N, USB_Zero_P

### Nets
+1V1: C719.1 C720.1 C721.1 C722.1 C723.1 C724.1 C725.1 C726.1 C727.1 C728.1 C729.1 C730.1 C731.1 C732.1 C733.1 C734.1 C735.1 C736.1 C737.1 IC701.9(VCORE) IC701.18(VCORE) IC701.25(VCORE) IC701.31(VCORE) IC701.38(VCORE) IC701.55(VCORE) IC701.78(VCORE) IC701.85(VCORE) IC701.93(VCORE) ; port +1V1
+3V3: C702.1 C703.1 C704.1 C705.1 C706.1 C707.1 C708.1 C709.1 C710.1 C711.1 C712.1 C713.1 C714.1 C715.1 C716.1 C717.1 C718.1 C739.1 D702.1(A) IC701.26(VDD33) IC701.43(VDD33) IC701.53(VDD33) IC701.62(VDD33) IC701.67(VDD33) IC701.79(VDD33) IC701.88(VDD33) IC701.99(VDD33) IC703.5(VCC) R702.2 R706.1 R707.1 R708.1 SW701.1 SW701.2 ; port +3V3
GND: C702.2 C703.2 C704.2 C705.2 C706.2 C707.2 C708.2 C709.2 C710.2 C711.2 C712.2 C713.2 C714.2 C715.2 C716.2 C717.2 C718.2 C719.2 C720.2 C721.2 C722.2 C723.2 C724.2 C725.2 C726.2 C727.2 C728.2 C729.2 C730.2 C731.2 C732.2 C733.2 C734.2 C735.2 C736.2 C737.2 C738.2 C739.2 C740.1 C741.2 IC701.24(TESTEN) IC701.101(GND) IC702.4(GND) IC703.3(GND) R703.2 R704.1 R705.1 R712.1 R713.1 R714.1 R715.1 R717.1 R718.1 R719.1 R720.1 R721.1 R722.1 R723.1 R724.1 R725.1 R726.1 R727.1 R728.1 X701.2 X701.4 ; port GND
3v3_G2: C738.1 D702.3(K) IC702.8(VCC)
ACTIVE_USB_G2: R716.2 ; port COMM.ACTIVE_USB_G2
CFG_STRAP1_G2: IC701.21(CFG_STRAP1) R703.1
CFG_STRAP2_G2: IC701.22(CFG_STRAP2) R704.2
CFG_STRAP3_G2: IC701.23(CFG_STRAP3) R705.2
I2C_0_SCL: IC701.75(PF26) ; port COMM.I2C_0_SCL
I2C_0_SDA: IC701.76(PF27) ; port COMM.I2C_0_SDA
I2S_LRCK_G2: IC701.47(PF6) R721.2
I2S_MCLK_G2: IC701.48(PF7) R722.2
I2S_SCK_G2: IC701.46(PF5) R720.2
I2S_SD0_G2: IC701.45(PF4) R719.2
I2S_SDI_G2: IC701.44(PF3) R718.2
MIC_DET_G2: IC701.66(PF19) R727.2
MSTR_I2C_CLK_G2: IC701.61(PF18) R726.2
MSTR_I2C_DATA_G2: IC701.3(PF31) R728.2
PRT_CTL1_G2: IC701.60(PF17)
PRT_CTL2_G2: IC701.59(PF16)
PRT_CTL3_G2: IC701.58(PF15)
PRT_CTL3_U3_G2: IC701.51(PF10) R723.2
PRT_CTL4_G2: IC701.57(PF14)
PRT_CTL4_U3_G2: IC701.52(PF11) R724.2
PRT_CTL5_G2: IC701.56(PF13)
PRT_CTL5_U3_G2: IC701.54(PF12) R725.2
PRT_CTL6_G2: IC701.77(PF28)
RESET_USB_G2: R711.2 ; port COMM.RESET_USB_G2
SPI_CEN_G2: IC701.69(SPI_CE_N/CFG_NON_REM/PF20) IC702.1(~{CS}) R702.1
SPI_CLK_G2: IC701.68(SPI_CLK/PF21) IC702.6(SCK)
SPI_HLD_G2: IC701.73(SPI_D3/PF25) IC702.7(~{HOLD})
SPI_MISO_G2: IC701.71(SPI_D1/PF23) IC702.2(SO)
SPI_MOSI_G2: IC701.70(SPI_D0/CFG_BC_EN/PF22) IC702.5(SI)
SPI_WP_G2: IC701.72(SPI_D2/PF24) IC702.3(~{WP})
U3_SEL: port USB3.USB3_SEL
U4_SEL: port USB4.USB4_SEL
U6_SEL: port USB6.USB6_SEL
U7_SEL: port USB7.USB7_SEL
UMHG_SEL: port USBMHG.USBMHG_SEL
USB3_5V: port USB3.USB3_5V
USB3_CC1: port USB3.USB3_CC
USB3_CC2: port USB3.USB3_SBU
USB3_N: IC701.15(USB2DN_DM2/PRT_DIS_M2) ; port USB3.USB3_N
USB3_P: IC701.14(USB2DN_DP2/PRT_DIS_P2) ; port USB3.USB3_P
USB3_RX_N: IC701.20(USB3DN_RXDM2) ; port USB3.USB3_RX_N
USB3_RX_P: IC701.19(USB3DN_RXDP2) ; port USB3.USB3_RX_P
USB3_TX_N: IC701.17(USB3DN_TXDM2) ; port USB3.USB3_TX_N
USB3_TX_P: IC701.16(USB3DN_TXDP2) ; port USB3.USB3_TX_P
USB4_5V: port USB4.USB4_5V
USB4_CC1: port USB4.USB4_CC
USB4_CC2: port USB4.USB4_SBU
USB4_N: IC701.28(USB2DN_DM3/PRT_DIS_M3) ; port USB4.USB4_N
USB4_P: IC701.27(USB2DN_DP3/PRT_DIS_P3) ; port USB4.USB4_P
USB4_RX_N: IC701.33(USB3DN_RXDM3) ; port USB4.USB4_RX_N
USB4_RX_P: IC701.32(USB3DN_RXDP3) ; port USB4.USB4_RX_P
USB4_TX_N: IC701.30(USB3DN_TXDM3) ; port USB4.USB4_TX_N
USB4_TX_P: IC701.29(USB3DN_TXDP3) ; port USB4.USB4_TX_P
USB6_5V: port USB6.USB6_5V
USB6_CC1: port USB6.USB6_CC
USB6_CC2: port USB6.USB6_SBU
USB6_N: IC701.6(USB2DN_DM1/PRT_DIS_M1) ; port USB6.USB6_N
USB6_P: IC701.5(USB2DN_DP1/PRT_DIS_P1) ; port USB6.USB6_P
USB6_RX_N: IC701.11(USB3DN_RXDM1) ; port USB6.USB6_RX_N
USB6_RX_P: IC701.10(USB3DN_RXDP1) ; port USB6.USB6_RX_P
USB6_TX_N: IC701.8(USB3DN_TXDM1) ; port USB6.USB6_TX_N
USB6_TX_P: IC701.7(USB3DN_TXDP1) ; port USB6.USB6_TX_P
USB7_5V: port USB7.USB7_5V
USB7_CC1: port USB7.USB7_CC
USB7_CC2: port USB7.USB7_SBU
USB7_N: IC701.35(USB2DN_DM4/PRT_DIS_M4) ; port USB7.USB7_N
USB7_P: IC701.34(USB2DN_DP4/PRT_DIS_P4) ; port USB7.USB7_P
USB7_RX_N: IC701.40(USB3DN_RXDM4) ; port USB7.USB7_RX_N
USB7_RX_P: IC701.39(USB3DN_RXDP4) ; port USB7.USB7_RX_P
USB7_TX_N: IC701.37(USB3DN_TXDM4) ; port USB7.USB7_TX_N
USB7_TX_P: IC701.36(USB3DN_TXDP4) ; port USB7.USB7_TX_P
USBMHG_5V: port USBMHG.USBMHG_5V
USBMHG_CC1: port USBMHG.USBMHG_CC
USBMHG_CC2: port USBMHG.USBMHG_SBU
USBMHG_N: IC701.90(USB2UP_DM) ; port USBMHG.USBMHG_N
USBMHG_P: IC701.89(USB2UP_DP) ; port USBMHG.USBMHG_P
USBMHG_RX_N: C743.2 ; port USBMHG.USBMHG_RX_N
USBMHG_RX_P: C742.2 ; port USBMHG.USBMHG_RX_P
USBMHG_TX_N: IC701.92(USB3UP_TXDM) ; port USBMHG.USBMHG_TX_N
USBMHG_TX_P: IC701.91(USB3UP_TXDP) ; port USBMHG.USBMHG_TX_P
USBMHG_XRX_N: C743.1 IC701.95(USB3UP_RXDM)
USBMHG_XRX_P: C742.1 IC701.94(USB3UP_RXDP)
VBUS_DET_G2: IC701.2(PF30/VBUS_MON_UP) R716.1 R717.2
XTI_G2: C740.2 IC701.98(XTALI/CLK_IN) X701.1
XTO_G2: C741.1 IC701.97(XTALO) X701.3
NetIC701_1: IC701.1(RESET_N) R710.2 R715.2
NetIC701_63: IC701.63(TEST1) R706.2
NetIC701_64: IC701.64(TEST2) R707.2
NetIC701_65: IC701.65(TEST3) R708.2
NetIC701_100: IC701.100(RBIAS) R712.2
NetIC703_1: IC703.1(B) R711.1 R713.2
NetIC703_2: IC703.2(A) R709.1 R714.2
NetIC703_4: IC703.4(Y) R710.1
NetR709_2: R709.2 SW701.3 SW701.4

Not connected (* = marked no-connect by the designer): IC701 4(NC) 12(NC) 13(NC) 41(USB2DN_DM6/PRT_DIS_M6) 42(USB2DN_DP6/PRT_DIS_P6) 49(PF8)* 50(PF9)* 74(PF29) 80(NC) 81(USB2DN_DP5/PRT_DIS_P5) 82(USB2DN_DM5/PRT_DIS_M5) 83(USB3DN_TXDP5) 84(USB3DN_TXDM5) 86(USB3DN_RXDP5) 87(USB3DN_RXDM5) 96(ATEST)*

### Layout directives
differential pair; differential pair class USB3: USB3_N, USB3_P, USB3_RX_N, USB3_RX_P, USB3_TX_N, USB3_TX_P, USB4_N, USB4_P, USB4_RX_N, USB4_RX_P, USB4_TX_N, USB4_TX_P, USB6_N, USB6_P, USB6_RX_N, USB6_RX_P, USB6_TX_N, USB6_TX_P, USB7_N, USB7_P, USB7_RX_N, USB7_RX_P, USB7_TX_N, USB7_TX_P, USBMHG_N, USBMHG_P, USBMHG_RX_N, USBMHG_RX_P, USBMHG_TX_N, USBMHG_TX_P, USBMHG_XRX_N, USBMHG_XRX_P
net class SPI_GRID2: SPI_CLK_G2, SPI_MISO_G2, SPI_MOSI_G2

### Notes on the sheet
- Title
- Size:
- Date:
- File:
- A2
- Number:
- Time:
- Revision:
- Sheet
- of
- (in symbol IC0061) ≥1

### Library data of the parts
C702 C719 = CA0002: as C602 on sheet 601_USBHub-Grid-Part1; RefVal: 4.7µF
C703 C705 C707 C709 C711 C713 C715 C717 C720 C722 C724 C726 C728 C730 C732 C734 C736 C738 C739 C742 C743 = CA0010: as C601 on sheet 601_USBHub-Grid-Part1; RefVal: 100nF
C704 C706 C708 C710 C712 C714 C716 C718 C721 C723 C725 C727 C729 C731 C733 C735 C737 = CA0031: as C604 on sheet 601_USBHub-Grid-Part1; RefVal: 1nF
C740 C741 = CA0059: as C639 on sheet 601_USBHub-Grid-Part1; RefVal: 12pF
D702 = DI0010: as D601 on sheet 601_USBHub-Grid-Part1; RefVal: BAS16
IC701 = IC0065: as IC601 on sheet 601_USBHub-Grid-Part1; RefVal: USB7206C; ManfactPart: USB7206C
IC702 = IC0059: as IC602 on sheet 601_USBHub-Grid-Part1; RefVal: SST26VF016B
IC703 = IC0061: as IC603 on sheet 601_USBHub-Grid-Part1; RefVal: MC74HC1G02
R702 R703 R706-R711 = RS0011: as R601 on sheet 601_USBHub-Grid-Part1; RefVal: 10KΩ
R704 R705 R718-R728 = RS0045: as R603 on sheet 601_USBHub-Grid-Part1; RefVal: 200KΩ
R712 = RS0015: as R611 on sheet 601_USBHub-Grid-Part1; RefVal: 12KΩ
R713-R715 = RS0036: as R612-R614 on sheet 601_USBHub-Grid-Part1; RefVal: 100KΩ
R716 = RS0038: as R615 on sheet 601_USBHub-Grid-Part1; RefVal: 5.1kΩ
R717 = RS0040: as R616 on sheet 601_USBHub-Grid-Part1; RefVal: 22.1KΩ
SW701 = SW0005: as SW601 on sheet 601_USBHub-Grid-Part1; RefVal: TS02
X701 = CR0003: as X601 on sheet 601_USBHub-Grid-Part1; RefVal: 25MHz

## Nets that join several sheets
+1V1: 101_Power (C141.1 IC105.3 L104.2), 601_USBHub-Grid-Part1 (28 pins), 801_USBHub-Framework (28 pins), 701_USBHub-Grid-Part2 (28 pins)
+1V8: 101_Power (C126.1 IC103.3 L102.2), 301_FrameUSB (8 pins)
+3V3: 101_Power (8 pins), 401_FramePWR (8 pins), 201_ConnectionPart2-Part1 (CO101.A7 CO101.B7), 601_USBHub-Grid-Part1 (34 pins), 801_USBHub-Framework (34 pins), 701_USBHub-Grid-Part2 (34 pins)
+5VR: 101_Power (16 pins), 501_RPi0 (11 pins), 401_FramePWR (12 pins), 201_ConnectionPart2-Part1 (CO101.A6 CO101.B6)
GND: 001_OverViewMainHub-part2 (H1.1 H2.1 H3.1 H4.1), 101_Power (64 pins), 301_FrameUSB (40 pins), 501_RPi0 (26 pins), 401_FramePWR (96 pins), 201_ConnectionPart2-Part1 (36 pins), 601_USBHub-Grid-Part1 (65 pins), 801_USBHub-Framework (65 pins), 701_USBHub-Grid-Part2 (65 pins)
VPWR: 101_Power (24 pins), 401_FramePWR (32 pins), 201_ConnectionPart2-Part1 (10 pins)
ACTIVE_USB_F: 501_RPi0 (J505.2), 801_USBHub-Framework (R814.2)
ACTIVE_USB_G1: 501_RPi0 (J503.2), 601_USBHub-Grid-Part1 (R615.2)
ACTIVE_USB_G2: 501_RPi0 (J504.2), 701_USBHub-Grid-Part2 (R716.2)
I2C_0_SCL: 501_RPi0 (IC501.2 MO501.5 R501.1), 401_FramePWR (IC302.9 IC303.9 IC304.9 IC305.9), 601_USBHub-Grid-Part1 (IC601.75), 801_USBHub-Framework (IC801.75), 701_USBHub-Grid-Part2 (IC701.75)
I2C_0_SDA: 501_RPi0 (IC501.1 MO501.3 R502.1), 401_FramePWR (IC302.8 IC303.8 IC304.8 IC305.8), 601_USBHub-Grid-Part1 (IC601.76), 801_USBHub-Framework (IC801.76), 701_USBHub-Grid-Part2 (IC701.76)
I2C_IRQ_F0: 501_RPi0 (R504.2), 401_FramePWR (IC302.10 R401.2)
I2C_IRQ_F1: 501_RPi0 (R503.2), 401_FramePWR (IC303.10 R402.2)
I2C_IRQ_F2: 501_RPi0 (R506.2), 401_FramePWR (IC304.10 R403.2)
I2C_IRQ_F3: 501_RPi0 (R505.2), 401_FramePWR (IC305.10 R404.2)
RESET_USB_F: 501_RPi0 (MO501.40), 801_USBHub-Framework (R809.2)
RESET_USB_G1: 501_RPi0 (MO501.38), 601_USBHub-Grid-Part1 (R610.2)
RESET_USB_G2: 501_RPi0 (MO501.35), 701_USBHub-Grid-Part2 (R711.2)
USB0_N: 201_ConnectionPart2-Part1 (CO101.A13), 601_USBHub-Grid-Part1 (IC601.35)
USB0_P: 201_ConnectionPart2-Part1 (CO101.A14), 601_USBHub-Grid-Part1 (IC601.34)
USB0_RX_N: 201_ConnectionPart2-Part1 (CO101.A16), 601_USBHub-Grid-Part1 (IC601.40)
USB0_RX_P: 201_ConnectionPart2-Part1 (CO101.A17), 601_USBHub-Grid-Part1 (IC601.39)
USB0_TX_N: 201_ConnectionPart2-Part1 (CO101.A9), 601_USBHub-Grid-Part1 (IC601.37)
USB0_TX_P: 201_ConnectionPart2-Part1 (CO101.A10), 601_USBHub-Grid-Part1 (IC601.36)
USB1_N: 201_ConnectionPart2-Part1 (CO101.A24), 601_USBHub-Grid-Part1 (IC601.28)
USB1_P: 201_ConnectionPart2-Part1 (CO101.A25), 601_USBHub-Grid-Part1 (IC601.27)
USB1_RX_N: 201_ConnectionPart2-Part1 (CO101.A27), 601_USBHub-Grid-Part1 (IC601.33)
USB1_RX_P: 201_ConnectionPart2-Part1 (CO101.A28), 601_USBHub-Grid-Part1 (IC601.32)
USB1_TX_N: 201_ConnectionPart2-Part1 (CO101.A21), 601_USBHub-Grid-Part1 (IC601.30)
USB1_TX_P: 201_ConnectionPart2-Part1 (CO101.A22), 601_USBHub-Grid-Part1 (IC601.29)
USB2_N: 201_ConnectionPart2-Part1 (CO101.A44), 601_USBHub-Grid-Part1 (IC601.6)
USB2_P: 201_ConnectionPart2-Part1 (CO101.A45), 601_USBHub-Grid-Part1 (IC601.5)
USB2_RX_N: 201_ConnectionPart2-Part1 (CO101.A48), 601_USBHub-Grid-Part1 (IC601.10)
USB2_RX_P: 201_ConnectionPart2-Part1 (CO101.A47), 601_USBHub-Grid-Part1 (IC601.11)
USB2_TX_N: 201_ConnectionPart2-Part1 (CO101.A42), 601_USBHub-Grid-Part1 (IC601.7)
USB2_TX_P: 201_ConnectionPart2-Part1 (CO101.A41), 601_USBHub-Grid-Part1 (IC601.8)
USB3_N: 201_ConnectionPart2-Part1 (CO101.B25), 701_USBHub-Grid-Part2 (IC701.15)
USB3_P: 201_ConnectionPart2-Part1 (CO101.B24), 701_USBHub-Grid-Part2 (IC701.14)
USB3_RX_N: 201_ConnectionPart2-Part1 (CO101.B22), 701_USBHub-Grid-Part2 (IC701.20)
USB3_RX_P: 201_ConnectionPart2-Part1 (CO101.B21), 701_USBHub-Grid-Part2 (IC701.19)
USB3_TX_N: 201_ConnectionPart2-Part1 (CO101.B28), 701_USBHub-Grid-Part2 (IC701.17)
USB3_TX_P: 201_ConnectionPart2-Part1 (CO101.B27), 701_USBHub-Grid-Part2 (IC701.16)
USB4_N: 201_ConnectionPart2-Part1 (CO101.B36), 701_USBHub-Grid-Part2 (IC701.28)
USB4_P: 201_ConnectionPart2-Part1 (CO101.B35), 701_USBHub-Grid-Part2 (IC701.27)
USB4_RX_N: 201_ConnectionPart2-Part1 (CO101.B31), 701_USBHub-Grid-Part2 (IC701.33)
USB4_RX_P: 201_ConnectionPart2-Part1 (CO101.B30), 701_USBHub-Grid-Part2 (IC701.32)
USB4_TX_N: 201_ConnectionPart2-Part1 (CO101.B39), 701_USBHub-Grid-Part2 (IC701.30)
USB4_TX_P: 201_ConnectionPart2-Part1 (CO101.B38), 701_USBHub-Grid-Part2 (IC701.29)
USB5_N: 201_ConnectionPart2-Part1 (CO101.A35), 601_USBHub-Grid-Part1 (IC601.15)
USB5_P: 201_ConnectionPart2-Part1 (CO101.A36), 601_USBHub-Grid-Part1 (IC601.14)
USB5_RX_N: 201_ConnectionPart2-Part1 (CO101.A38), 601_USBHub-Grid-Part1 (IC601.20)
USB5_RX_P: 201_ConnectionPart2-Part1 (CO101.A39), 601_USBHub-Grid-Part1 (IC601.19)
USB5_TX_N: 201_ConnectionPart2-Part1 (CO101.A30), 601_USBHub-Grid-Part1 (IC601.17)
USB5_TX_P: 201_ConnectionPart2-Part1 (CO101.A31), 601_USBHub-Grid-Part1 (IC601.16)
USB6_N: 201_ConnectionPart2-Part1 (CO101.B14), 701_USBHub-Grid-Part2 (IC701.6)
USB6_P: 201_ConnectionPart2-Part1 (CO101.B13), 701_USBHub-Grid-Part2 (IC701.5)
USB6_RX_N: 201_ConnectionPart2-Part1 (CO101.B10), 701_USBHub-Grid-Part2 (IC701.11)
USB6_RX_P: 201_ConnectionPart2-Part1 (CO101.B9), 701_USBHub-Grid-Part2 (IC701.10)
USB6_TX_N: 201_ConnectionPart2-Part1 (CO101.B17), 701_USBHub-Grid-Part2 (IC701.8)
USB6_TX_P: 201_ConnectionPart2-Part1 (CO101.B16), 701_USBHub-Grid-Part2 (IC701.7)
USB7_N: 201_ConnectionPart2-Part1 (CO101.B45), 701_USBHub-Grid-Part2 (IC701.35)
USB7_P: 201_ConnectionPart2-Part1 (CO101.B44), 701_USBHub-Grid-Part2 (IC701.34)
USB7_RX_N: 201_ConnectionPart2-Part1 (CO101.B42), 701_USBHub-Grid-Part2 (IC701.40)
USB7_RX_P: 201_ConnectionPart2-Part1 (CO101.B41), 701_USBHub-Grid-Part2 (IC701.39)
USB7_TX_N: 201_ConnectionPart2-Part1 (CO101.B48), 701_USBHub-Grid-Part2 (IC701.37)
USB7_TX_P: 201_ConnectionPart2-Part1 (CO101.B47), 701_USBHub-Grid-Part2 (IC701.36)
USB_Zero_N: 501_RPi0 (CO502.1), 801_USBHub-Framework (IC801.42)
USB_Zero_P: 501_RPi0 (CO501.1), 801_USBHub-Framework (IC801.41)
USBF0_5V: 301_FrameUSB (CO301.4 CO301.9 CO301.24 CO301.29), 401_FramePWR (5 pins)
USBF0_CC1: 301_FrameUSB (CO301.5), 401_FramePWR (IC302.28)
USBF0_CC2: 301_FrameUSB (CO301.25), 401_FramePWR (IC302.29)
USBF0_N: 301_FrameUSB (CO301.7 CO301.27 D351.1), 801_USBHub-Framework (IC801.15)
USBF0_P: 301_FrameUSB (CO301.6 CO301.26 D351.2), 801_USBHub-Framework (IC801.14)
USBF0_RX_N: 301_FrameUSB (C309.1), 801_USBHub-Framework (IC801.20)
USBF0_RX_P: 301_FrameUSB (C313.1), 801_USBHub-Framework (IC801.19)
USBF0_SEL: 301_FrameUSB (IC351.16), 401_FramePWR (IC302.5)
USBF0_TX_N: 301_FrameUSB (C301.1), 801_USBHub-Framework (IC801.17)
USBF0_TX_P: 301_FrameUSB (C305.1), 801_USBHub-Framework (IC801.16)
USBF1_5V: 301_FrameUSB (CO302.4 CO302.9 CO302.24 CO302.29), 401_FramePWR (5 pins)
USBF1_CC1: 301_FrameUSB (CO302.5), 401_FramePWR (IC303.28)
USBF1_CC2: 301_FrameUSB (CO302.25), 401_FramePWR (IC303.29)
USBF1_N: 301_FrameUSB (CO302.7 CO302.27 D352.1), 801_USBHub-Framework (IC801.90)
USBF1_P: 301_FrameUSB (CO302.6 CO302.26 D352.2), 801_USBHub-Framework (IC801.89)
USBF1_RX_N: 301_FrameUSB (C310.1), 801_USBHub-Framework (IC801.95)
USBF1_RX_P: 301_FrameUSB (C314.1), 801_USBHub-Framework (IC801.94)
USBF1_SEL: 301_FrameUSB (IC352.16), 401_FramePWR (IC303.5)
USBF1_TX_N: 301_FrameUSB (C302.1), 801_USBHub-Framework (IC801.92)
USBF1_TX_P: 301_FrameUSB (C306.1), 801_USBHub-Framework (IC801.91)
USBF2_5V: 301_FrameUSB (CO303.4 CO303.9 CO303.24 CO303.29), 401_FramePWR (5 pins)
USBF2_CC1: 301_FrameUSB (CO303.5), 401_FramePWR (IC304.28)
USBF2_CC2: 301_FrameUSB (CO303.25), 401_FramePWR (IC304.29)
USBF2_N: 301_FrameUSB (CO303.7 CO303.27 D355.1), 801_USBHub-Framework (IC801.35)
USBF2_P: 301_FrameUSB (CO303.6 CO303.26 D355.2), 801_USBHub-Framework (IC801.34)
USBF2_RX_N: 301_FrameUSB (C371.1), 801_USBHub-Framework (IC801.40)
USBF2_RX_P: 301_FrameUSB (C375.1), 801_USBHub-Framework (IC801.39)
USBF2_SEL: 301_FrameUSB (IC353.16), 401_FramePWR (IC304.5)
USBF2_TX_N: 301_FrameUSB (C321.1), 801_USBHub-Framework (IC801.37)
USBF2_TX_P: 301_FrameUSB (C367.1), 801_USBHub-Framework (IC801.36)
USBF3_5V: 301_FrameUSB (CO304.4 CO304.9 CO304.24 CO304.29), 401_FramePWR (5 pins)
USBF3_CC1: 301_FrameUSB (CO304.5), 401_FramePWR (IC305.28)
USBF3_CC2: 301_FrameUSB (CO304.25), 401_FramePWR (IC305.29)
USBF3_N: 301_FrameUSB (CO304.7 CO304.27 D356.1), 801_USBHub-Framework (IC801.6)
USBF3_P: 301_FrameUSB (CO304.6 CO304.26 D356.2), 801_USBHub-Framework (IC801.5)
USBF3_RX_N: 301_FrameUSB (C372.1), 801_USBHub-Framework (IC801.11)
USBF3_RX_P: 301_FrameUSB (C376.1), 801_USBHub-Framework (IC801.10)
USBF3_SEL: 301_FrameUSB (IC354.16), 401_FramePWR (IC305.5)
USBF3_TX_N: 301_FrameUSB (C322.1), 801_USBHub-Framework (IC801.8)
USBF3_TX_P: 301_FrameUSB (C368.1), 801_USBHub-Framework (IC801.7)
USBMHF_N: 601_USBHub-Grid-Part1 (IC601.90), 801_USBHub-Framework (IC801.28)
USBMHF_P: 601_USBHub-Grid-Part1 (IC601.89), 801_USBHub-Framework (IC801.27)
USBMHF_RX_N: 601_USBHub-Grid-Part1 (C642.2), 801_USBHub-Framework (IC801.30)
USBMHF_RX_P: 601_USBHub-Grid-Part1 (C641.2), 801_USBHub-Framework (IC801.29)
USBMHF_TX_N: 601_USBHub-Grid-Part1 (IC601.92), 801_USBHub-Framework (C838.2)
USBMHF_TX_P: 601_USBHub-Grid-Part1 (IC601.91), 801_USBHub-Framework (C837.2)
USBMHG_N: 601_USBHub-Grid-Part1 (IC601.82), 701_USBHub-Grid-Part2 (IC701.90)
USBMHG_P: 601_USBHub-Grid-Part1 (IC601.81), 701_USBHub-Grid-Part2 (IC701.89)
USBMHG_RX_N: 601_USBHub-Grid-Part1 (IC601.84), 701_USBHub-Grid-Part2 (C743.2)
USBMHG_RX_P: 601_USBHub-Grid-Part1 (IC601.83), 701_USBHub-Grid-Part2 (C742.2)
USBMHG_TX_N: 601_USBHub-Grid-Part1 (C644.2), 701_USBHub-Grid-Part2 (IC701.92)
USBMHG_TX_P: 601_USBHub-Grid-Part1 (C643.2), 701_USBHub-Grid-Part2 (IC701.91)